# Altium project PCB_Project.PrjPcb (part 1 of 2)
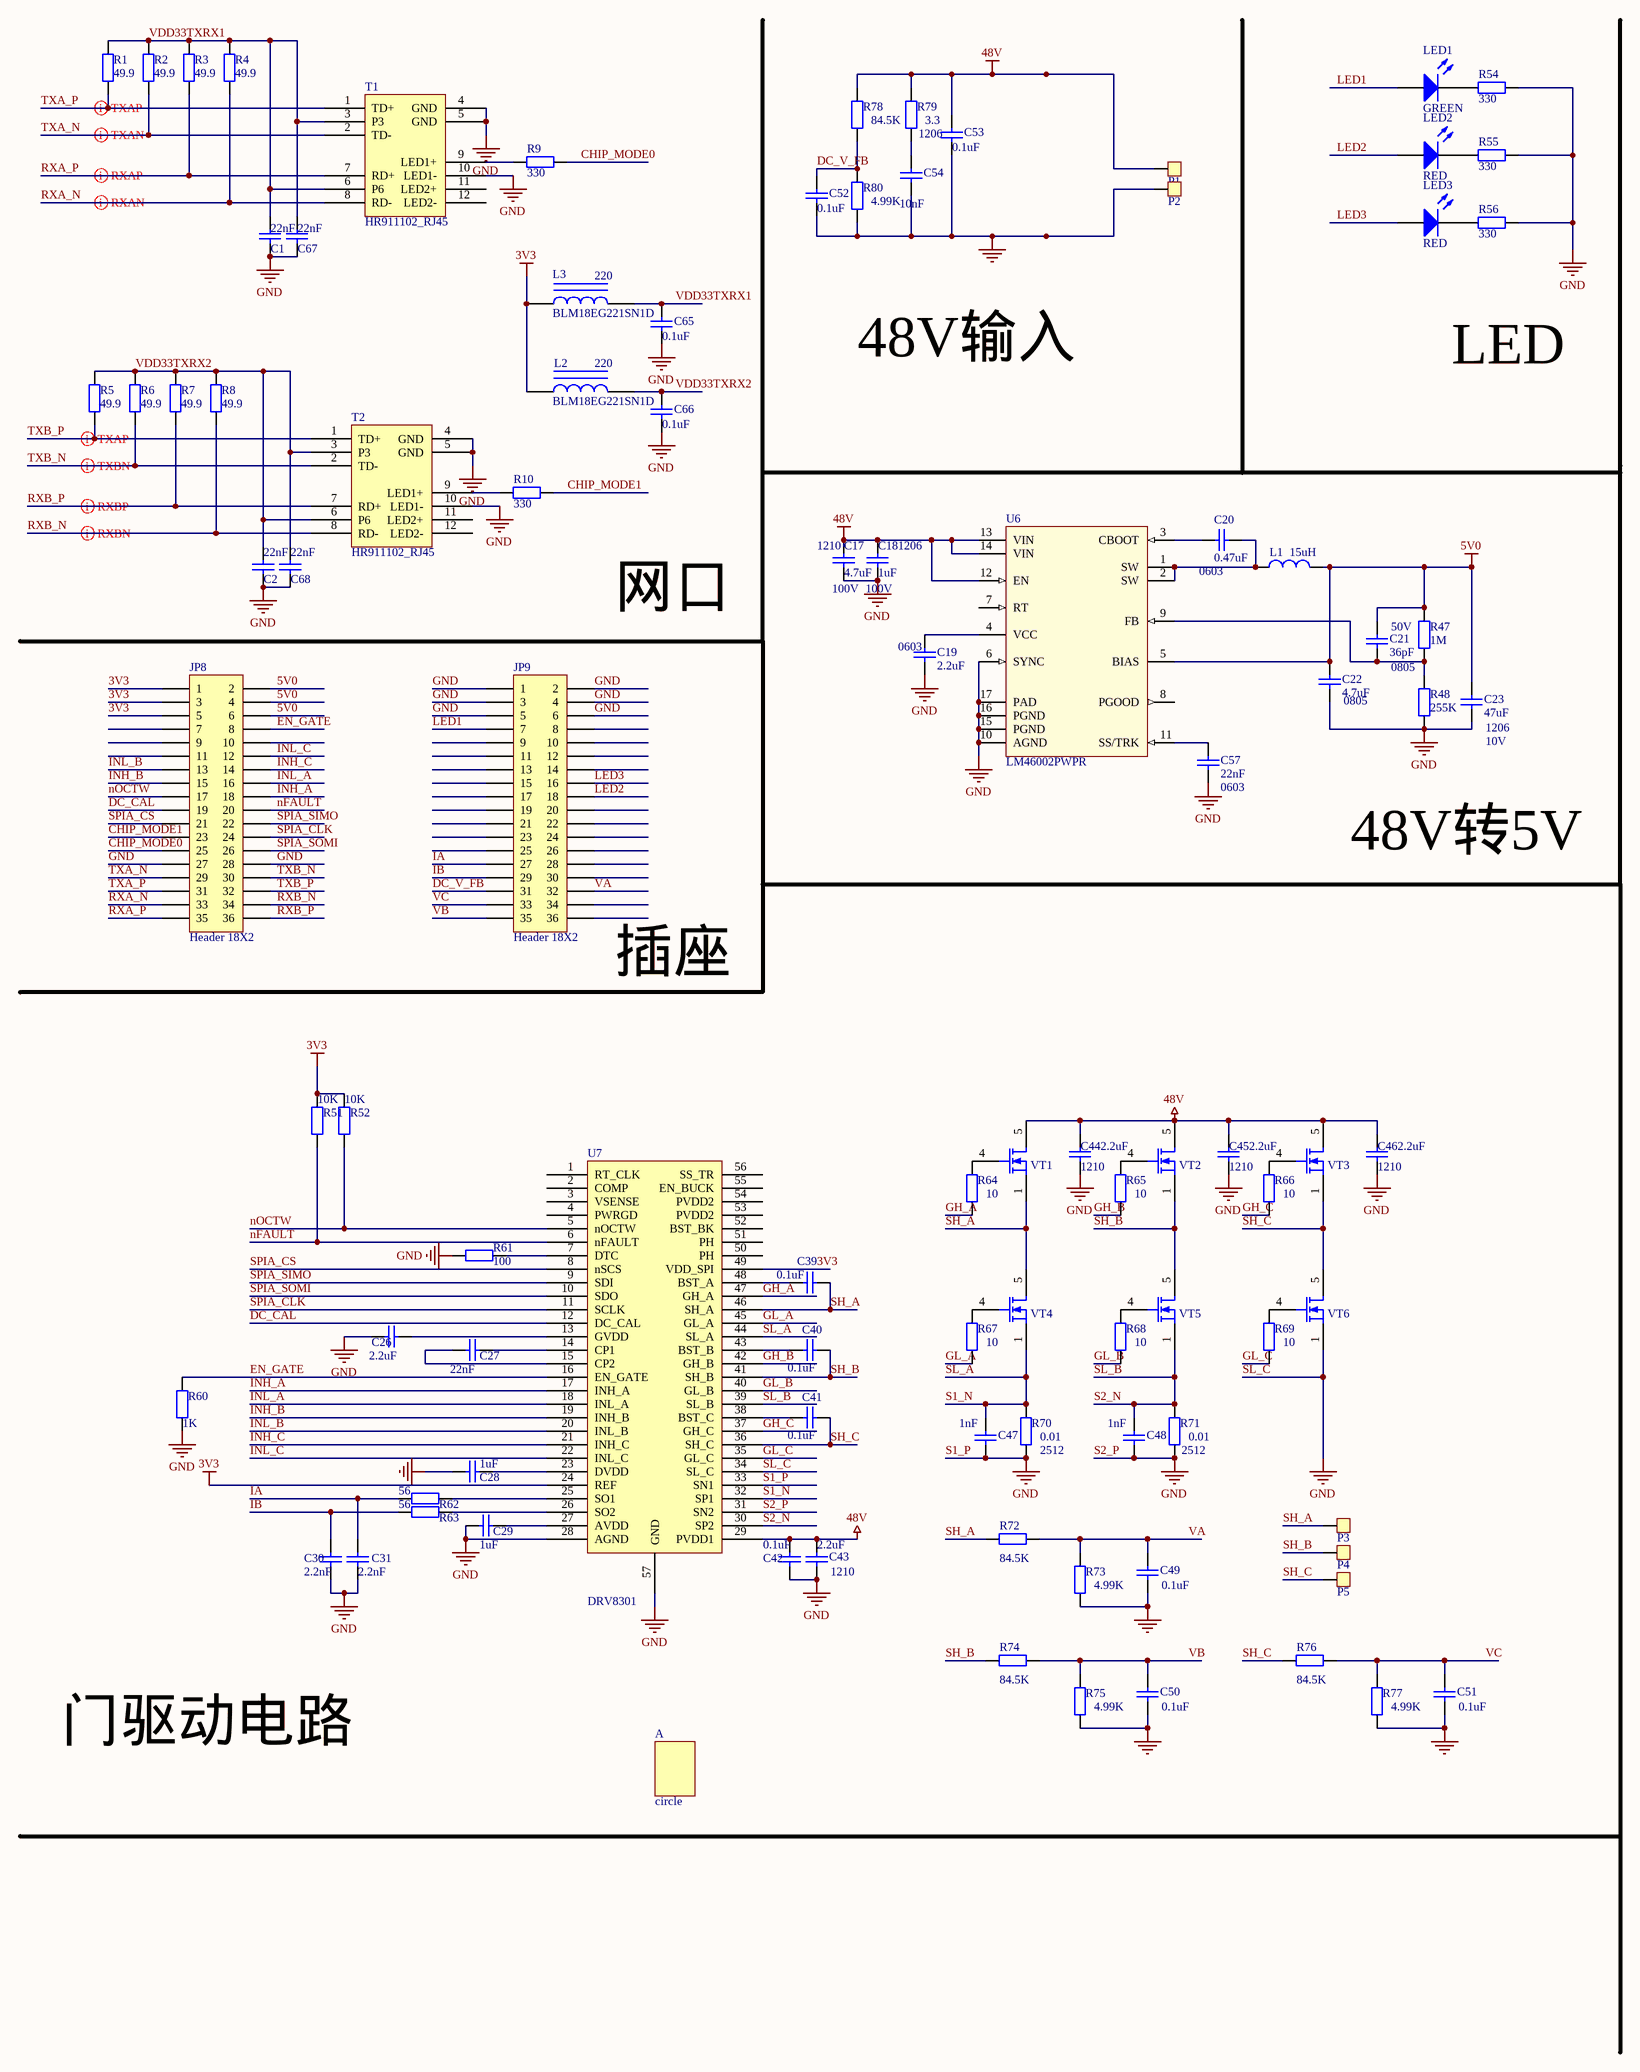
[diagram p0: diban.SchDoc]
4 sheets, 408 parts. Net scope: global (net labels, ports and power ports of the same name join across sheets).
Board files: diban_v1.0.PcbDoc, new.PcbDoc, diban_v1.0.~(10).PcbDoc, diban_v1.0.~(20).PcbDoc, encoder.PcbDoc
Sheets:
  diban.SchDoc
  new.SchDoc
  encoder.SchDoc
  Sheet1.SchDoc

## Sheet diban.SchDoc
size A2

### Parts
(Parts that share a designator on the sheet are numbered #1, #2 ... from top to bottom, then left to right.)
A#1  circle  [Circle]
C1#1  value 22nF  [CC1608-0603]  (hidden comment: 0603B223J6R3NT)
C2#1  value 22nF  [CC1608-0603]  (hidden comment: 0603B223J6R3NT)
C17#1  value 4.7uF  Voltage: 100V  Footpoint: 1210  [CC3225-1210]  (hidden comment: C3225X7S2A475M200AB)
C18  value 1uF  Voltage: 100V  Footpoint: 1206  [CC3216-1206]  (hidden comment: C3216X5R2A105K)
C19#1  value 2.2uF  Footpoint: 0603  [CC1608-0603]  (hidden comment: 0603B225J6R3NT)
C20#1  value 0.47uF  Footpoint: 0603  [CC1608-0603]  (hidden comment: 0603B474J6R3NT)
C21#1  value 36pF  Voltage: 50V  Footpoint: 0805  [CC2012-0805]  (hidden comment: CL21C360JBANNNC)
C22#1  value 4.7uF  Footpoint: 0805  [CC2012-0805]  (hidden comment: GRM21BR61E475KA12L)
C23#1  value 47uF  Footpoint: 1206  Voltage: 10V  [CC3216-1206]  (hidden comment: GRM31CR61A476KE15L)
C26#1  value 2.2uF  [CC2012-0805]  (hidden comment: 0603B225J6R3NT)
C27#1  value 22nF  [CC1608-0603]  (hidden comment: 0603B223J500NT)
C28#1  value 1uF  [CC1608-0603]  (hidden comment: 0603B105J250NT)
C29#1  value 1uF  [CC1608-0603]  (hidden comment: 0603B105J250NT)
C30#1  value 2.2nF  [CC1608-0603]  (hidden comment: 0603B222J6R3NT)
C31#1  value 2.2nF  [CC1608-0603]  (hidden comment: 0603B222J6R3NT)
C39#1  value 0.1uF  [CC1608-0603]  (hidden comment: 0603B104J500NT)
C40#1  value 0.1uF  [CC1608-0603]  (hidden comment: 0603B104J500NT)
C41#1  value 0.1uF  [CC1608-0603]  (hidden comment: 0603B104J500NT)
C42#1  value 0.1uF  [CC1608-0603]  (hidden comment: 0603B104J101NT)
C43#1  value 2.2uF  Footpoint: 1210  [CC3225-1210]  (hidden comment: GRM32ER72A225KA35L)
C44#1  value 2.2uF  Footpoint: 1210  [CC3225-1210]  (hidden comment: GRM32ER72A225KA35L)
C45#1  Footpoint: 1210  [CC3225-1210]  (hidden comment: GRM32ER72A225KA35L)
C46#1  Footpoint: 1210  [CC3225-1210]  (hidden comment: GRM32ER72A225KA35L)
C47#1  value 1nF  [CC1608-0603]  (hidden comment: 0603B102J500NT)
C48#1  value 1nF  [CC1608-0603]  (hidden comment: 0603B102J500NT)
C49#1  value 0.1uF  [CC1608-0603]  (hidden comment: 0603B104J160NT)
C50#1  value 0.1uF  [CC1608-0603]  (hidden comment: 0603B104J160NT)
C51#1  value 0.1uF  [CC1608-0603]  (hidden comment: 0603B104J160NT)
C52  value 0.1uF  [CC1608-0603]  (hidden comment: 0603B104J160NT)
C53#1  value 0.1uF  [CC1608-0603]  (hidden comment: 0603B104J101NT)
C54#1  value 10nF  [CC1608-0603]  (hidden comment: 0603B103J101NT)
C57#1  value 22nF  Footpoint: 0603  [CC1608-0603]  (hidden comment: 0603B223J6R3NT)
C65#1  value 0.1uF  [CC1608-0603]  (hidden comment: 0402B104J6R3NT)
C66#1  value 0.1uF  [CC1608-0603]  (hidden comment: 0402B104J6R3NT)
C67#1  value 22nF  [CC1608-0603]  (hidden comment: 0603B223J6R3NT)
C68#1  value 22nF  [CC1608-0603]  (hidden comment: 0603B223J6R3NT)
JP8  Header 18X2  [DC_1.27_36]
JP9  Header 18X2  [DC_1.27_36]
L1#1  value 15uH  [SPR6540]  (hidden comment: SPR6540-150M)
L2#1  BLM18EG221SN1D  value 220  [BLM0603]
L3#1  BLM18EG221SN1D  value 220  [BLM0603]
LED1  LED Chip  [0603D]  (value not drawn)
LED2  LED Chip  [0603D]  (value not drawn)
LED3  LED Chip  [0603D]  (value not drawn)
P1  PAD  [PAD]  (value not drawn)
P2  PAD  [PAD]  (value not drawn)
P3  PAD  [PAD]  (value not drawn)
P4  PAD  [PAD]  (value not drawn)
P5  PAD  [PAD]  (value not drawn)
R1#1  value 49.9  [CR1608-0603]  (hidden comment: RC03K49R9JT)
R2#1  value 49.9  [CR1608-0603]  (hidden comment: RC03K49R9JT)
R3#1  value 49.9  [CR1608-0603]  (hidden comment: RC03K49R9JT)
R4#1  value 49.9  [CR1608-0603]  (hidden comment: RC03K49R9JT)
R5#1  value 49.9  [CR1608-0603]  (hidden comment: RC03K49R9JT)
R6#1  value 49.9  [CR1608-0603]  (hidden comment: RC03K49R9JT)
R7#1  value 49.9  [CR1608-0603]  (hidden comment: RC03K49R9JT)
R8#1  value 49.9  [CR1608-0603]  (hidden comment: RC03K49R9JT)
R9#1  value 330  [CR1608-0603]  (hidden comment: RC03K331JT)
R10#1  value 330  [CR1608-0603]  (hidden comment: RC03K331JT)
R47  value 1M  [CR1608-0603]  (hidden comment: RC03K105JT)
R48#1  value 255K  [CR1608-0603]  (hidden comment: RC03K2553JT)
R51#1  value 10K  [CR1608-0603]  (hidden comment: RC03K103JT)
R52#1  value 10K  [CR1608-0603]  (hidden comment: RC03K103JT)
R54#1  value 330  [CR1608-0603]  (hidden comment: RC03K331JT)
R55#1  value 330  [CR1608-0603]  (hidden comment: RC03K331JT)
R56#1  value 330  [CR1608-0603]  (hidden comment: RC03K331JT)
R60#1  value 1K  [CR1608-0603]  (hidden comment: RC03K102JT)
R61  value 100  [CR1608-0603]  (hidden comment: RC03K101JT)
R62#1  value 56  [CR1608-0603]  (hidden comment: RC03K560JT)
R63#1  value 56  [CR1608-0603]  (hidden comment: RC03K560JT)
R64#1  value 10  [CR1608-0603]  (hidden comment: RC03K100JT)
R65#1  value 10  [CR1608-0603]  (hidden comment: RC03K100JT)
R66  value 10  [CR1608-0603]  (hidden comment: RC03K100JT)
R67  value 10  [CR1608-0603]  (hidden comment: RC03K100JT)
R68  value 10  [CR1608-0603]  (hidden comment: RC03K100JT)
R69  value 10  [CR1608-0603]  (hidden comment: RC03K100JT)
R70  value 0.01  Footpoint: 2512  [CR6332-2512]  (hidden comment: CRA2512-FZ-R010ELF)
R71  value 0.01  Footpoint: 2512  [CR6332-2512]  (hidden comment: CRA2512-FZ-R010ELF)
R72  value 84.5K  [CR1608-0603]  (hidden comment: RC03K8452JT)
R73  value 4.99K  [CR1608-0603]  (hidden comment: RC03K4991JT)
R74  value 84.5K  [CR1608-0603]  (hidden comment: RC03K8452JT)
R75  value 4.99K  [CR1608-0603]  (hidden comment: RC03K4991JT)
R76  value 84.5K  [CR1608-0603]  (hidden comment: RC03K8452JT)
R77  value 4.99K  [CR1608-0603]  (hidden comment: RC03K4991JT)
R78  value 84.5K  [CR1608-0603]  (hidden comment: RC03K8452JT)
R79  value 3.3  Footpoint: 1206  [CR3216-1206]  (hidden comment: CRCW12063R30JNEA)
R80  value 4.99K  [CR1608-0603]  (hidden comment: RC03K4991JT)
T1#1  HR911102_RJ45  [RJ45]
T2#1  HR911102_RJ45  [RJ45]
U6  LM46002PWPR  [IM46002]
U7#1  DRV8301  [DRV8301]
VT1  CSD18540  [CSD18540 - duplicate]  (value not drawn)
VT2  CSD18540  [CSD18540 - duplicate]  (value not drawn)
VT3  CSD18540  [CSD18540 - duplicate]  (value not drawn)
VT4  CSD18540  [CSD18540 - duplicate]  (value not drawn)
VT5  CSD18540  [CSD18540 - duplicate]  (value not drawn)
VT6  CSD18540  [CSD18540 - duplicate]  (value not drawn)

### Nets
3V3: JP8.1 JP8.3 JP8.5 L2#1.1 L3#1.1 R51#1.2 R52#1.2 U7#1.24(REF) U7#1.49(VDD_SPI)
5V0: C21#1.2 C22#1.2 C23#1.2 JP8.2 JP8.4 JP8.6 L1#1.2 R47.1 U6.5(BIAS)
48V: C17#1.1 C18.1 C42#1.2 C43#1.2 C44#1.1 C45#1.1 C46#1.1 C53#1.2 P1.1 R78.2 R79.2 U6.12(EN) U6.13(VIN) U6.14(VIN) U7#1.29(PVDD1) VT1.5(D) VT2.5(D) VT3.5(D)
GND: C1#1.1 C2#1.1 C17#1.2 C18.2 C19#1.2 C22#1.1 C23#1.1 C26#1.1 C28#1.1 C29#1.1 C30#1.1 C31#1.1 C42#1.1 C43#1.1 C44#1.2 C45#1.2 C46#1.2 C47#1.2 C48#1.2 C49#1.1 C50#1.1 C51#1.1 C52.1 C53#1.1 C54#1.1 C57#1.1 C65#1.1 C66#1.1 C67#1.1 C68#1.1 JP8.27 JP8.28 JP9.1 JP9.2 JP9.3 JP9.4 JP9.5 JP9.6 P2.1 R48#1.2 R54#1.1 R55#1.1 R56#1.1 R60#1.1 R61.1 R70.1 R71.1 R73.1 R75.1 R77.1 R80.1 T1#1.4(GND) T1#1.5(GND) T1#1.10(LED1-) T2#1.4(GND) T2#1.5(GND) T2#1.10(LED1-) U6.6(SYNC) U6.10(AGND) U6.15(PGND) U6.16(PGND) U6.17(PAD) U7#1.28(AGND) U7#1.31(SN2) U7#1.33(SN1) U7#1.34(SL_C) U7#1.57(GND) VT6.1(S)  [also labelled S1_P, S2_P, SL_C]
CHIP_MODE0: JP8.25 R9#1.1
CHIP_MODE1: JP8.23 R10#1.1
DC_CAL: JP8.19 U7#1.12(DC_CAL)
DC_V_FB: C52.2 JP9.31 R78.1 R80.2
EN_GATE: JP8.8 R60#1.2 U7#1.16(EN_GATE)
GH_A: R64#1.2 U7#1.47(GH_A)
GH_B: R65#1.2 U7#1.42(GH_B)
GH_C: R66.2 U7#1.37(GH_C)
GL_A: R67.2 U7#1.45(GL_A)
GL_B: R68.2 U7#1.40(GL_B)
GL_C: R69.2 U7#1.35(GL_C)
IA: C31#1.2 JP9.27 R62#1.1
IB: C30#1.2 JP9.29 R63#1.1
INH_A: JP8.18 U7#1.17(INH_A)
INH_B: JP8.15 U7#1.19(INH_B)
INH_C: JP8.14 U7#1.21(INH_C)
INL_A: JP8.16 U7#1.18(INL_A)
INL_B: JP8.13 U7#1.20(INL_B)
INL_C: JP8.12 U7#1.22(INL_C)
LED1: JP9.7 LED1.1(A)
LED2: JP9.18 LED2.1(A)
LED3: JP9.16 LED3.1(A)
nFAULT: JP8.20 R51#1.1 U7#1.6(nFAULT)
nOCTW: JP8.17 R52#1.1 U7#1.5(nOCTW)
RXA_N: JP8.33 R4#1.1 T1#1.8(RD-)
RXA_P: JP8.35 R3#1.1 T1#1.7(RD+)
RXB_N: JP8.34 R8#1.1 T2#1.8(RD-)
RXB_P: JP8.36 R7#1.1 T2#1.7(RD+)
S1_N: C47#1.1 R70.2 U7#1.32(SP1) U7#1.44(SL_A) VT4.1(S)  [also labelled SL_A]
S2_N: C48#1.1 R71.2 U7#1.30(SP2) U7#1.39(SL_B) VT5.1(S)  [also labelled SL_B]
SH_A: C39#1.2 P3.1 R72.1 U7#1.46(SH_A) VT1.1(S) VT4.5(D)
SH_B: C40#1.2 P4.1 R74.1 U7#1.41(SH_B) VT2.1(S) VT5.5(D)
SH_C: C41#1.2 P5.1 R76.1 U7#1.36(SH_C) VT3.1(S) VT6.5(D)
SPIA_CLK: JP8.24 U7#1.11(SCLK)
SPIA_CS: JP8.21 U7#1.8(nSCS)
SPIA_SIMO: JP8.22 U7#1.9(SDI)
SPIA_SOMI: JP8.26 U7#1.10(SDO)
TXA_N: JP8.29 R2#1.1 T1#1.2(TD-)
TXA_P: JP8.31 R1#1.1 T1#1.1(TD+)
TXB_N: JP8.30 R6#1.1 T2#1.2(TD-)
TXB_P: JP8.32 R5#1.1 T2#1.1(TD+)
VA: C49#1.2 JP9.32 R72.2 R73.2
VB: C50#1.2 JP9.35 R74.2 R75.2
VC: C51#1.2 JP9.33 R76.2 R77.2
VDD33TXRX1: C1#1.2 C65#1.2 C67#1.2 L3#1.2 R1#1.2 R2#1.2 R3#1.2 R4#1.2 T1#1.3(P3) T1#1.6(P6)
VDD33TXRX2: C2#1.2 C66#1.2 C68#1.2 L2#1.2 R5#1.2 R6#1.2 R7#1.2 R8#1.2 T2#1.3(P3) T2#1.6(P6)
NetC19#1_1: C19#1.1 U6.4(VCC)
NetC20#1_1: C20#1.1 U6.3(CBOOT)
NetC20#1_2: C20#1.2 L1#1.1 U6.1(SW) U6.2(SW)
NetC21#1_1: C21#1.1 R47.2 R48#1.1 U6.9(FB)
NetC26#1_2: C26#1.2 U7#1.13(GVDD)
NetC27#1_1: C27#1.1 U7#1.15(CP2)
NetC27#1_2: C27#1.2 U7#1.14(CP1)
NetC28#1_2: C28#1.2 U7#1.23(DVDD)
NetC29#1_2: C29#1.2 U7#1.27(AVDD)
NetC39#1_1: C39#1.1 U7#1.48(BST_A)
NetC40#1_1: C40#1.1 U7#1.43(BST_B)
NetC41#1_1: C41#1.1 U7#1.38(BST_C)
NetC54#1_2: C54#1.2 R79.1
NetC57#1_2: C57#1.2 U6.11(SS/TRK)
NetLED1_2: LED1.2(K) R54#1.2
NetLED2_2: LED2.2(K) R55#1.2
NetLED3_2: LED3.2(K) R56#1.2
NetR9#1_2: R9#1.2 T1#1.9(LED1+)
NetR10#1_2: R10#1.2 T2#1.9(LED1+)
NetR61_2: R61.2 U7#1.7(DTC)
NetR62#1_2: R62#1.2 U7#1.25(SO1)
NetR63#1_2: R63#1.2 U7#1.26(SO2)
NetR64#1_1: R64#1.1 VT1.4(G)
NetR65#1_1: R65#1.1 VT2.4(G)
NetR66_1: R66.1 VT3.4(G)
NetR67_1: R67.1 VT4.4(G)
NetR68_1: R68.1 VT5.4(G)
NetR69_1: R69.1 VT6.4(G)

Not connected (* = marked no-connect by the designer): JP8 7 9 10 11; JP9 8 9 10 11 12 13 14 15 17 19 20 21 22 23 24 25 26 28 30 34 36; T1#1 11(LED2+) 12(LED2-); T2#1 11(LED2+) 12(LED2-); U6 7(RT) 8(PGOOD); U7#1 1(RT_CLK) 2(COMP) 3(VSENSE) 4(PWRGD) 50(PH) 51(PH) 52(BST_BK) 53(PVDD2) 54(PVDD2) 55(EN_BUCK) 56(SS_TR)

### Layout directives
differential pair: RXA_N, RXA_P, RXB_N, RXB_P, TXA_N, TXA_P, TXB_N, TXB_P

### Notes on the sheet
- 48V输入
- LED
- 网口
- 48V转5V
- (near JP9) 插座
- 门驱动电路
- (in symbol CAP) 2.2uF
- (in symbol LED Chip) GREEN; RED

### Library data of the parts
C1#1 C2#1 C17#1 C18 C19#1 C20#1 C21#1 C22#1 C23#1 C26#1 C27#1 C28#1 C29#1 C30#1 C31#1 C39#1 C40#1 C41#1 C42#1 C43#1 C44#1 C45#1 C46#1 C47#1 C48#1 C49#1 C50#1 C51#1 C52 C53#1 C54#1 C57#1 C65#1 C66#1 C67#1 C68#1 = CAP
JP8 JP9 = Header 18X2: Header,36-Pin, Dual row; LatestRevisionDate: 17-Jul-2002; LatestRevisionNote: Re-released for DXP Platform.; Publisher: Altium Limited
L1#1 = Inductor Chip: Inductor; Published: *; Revision: *; Publisher: *
L2#1 L3#1 = Inductor Iron: Magnetic-Core Inductor; Published: *; Revision: *; Publisher: *
LED1-LED3 = LED Chip: Typical Chip LED; Published: 8-Jun-2000; Revision: July-2002: Re-released for DXP Platform.; Publisher: Altium Limited
R1#1 R2#1 R3#1 R4#1 R5#1 R6#1 R7#1 R8#1 R9#1 R10#1 R47 R48#1 R51#1 R52#1 R54#1 R55#1 R56#1 R60#1 R61 R62#1 R63#1 R64#1 R65#1 R66-R80 = Resistor
U6 = LM46002PWPR: Imported; Alternate Manufacturer: None; Manufacturer: Texas Instruments; CurrentTime: Not shown in title block; DocumentNumber: 1; SymbolCreator: a0411947; CompType: IC; U/M: EA; Designator: U?; PIN_COUNT: 17; CurrentDate: Not shown in title block; Time: Not shown in title block; Date: Not shown in title block; DocumentFullPathAndName: Not shown in title block; DocumentName: Not shown in title block; ModifiedDate: Not shown in title block; ApprovedBy: Not shown in title block; CheckedBy: Not shown in title block; Author: Not shown in title block; CompanyName: Not shown in title block; Engineer: Not shown in title block; Organization: Not shown in title block; Address1: Not shown in title block; Address2: Not shown in title block; Address3: Not shown in title block; Address4: Not shown in title block; Revision: Use project parameter SCH_Rev; SheetNumber: 1; SheetTotal: 1; ImagePath: Not shown in title block; Rule: *; ProjectName: *; SymbolVersion: 2014-01-28; PartNumber: LM46002PWP; PackageReference: PWP0016A; MountType: SMT; ComponentLink1Description: Datasheet Link; ComponentLink1URL: https://sps06.itg.ti.com/sites/KMS/crossdivteams/altium/docs/ComponentDatasheets/LM46002-PrelimDS-2014-1-16.pdf; RoHS: Y; Publisher: Texas Instruments; LatestRevisionDate: 2014-02-20; RefDes: RefDes; Type: DEV; Value: Value

## Sheet new.SchDoc
size A2
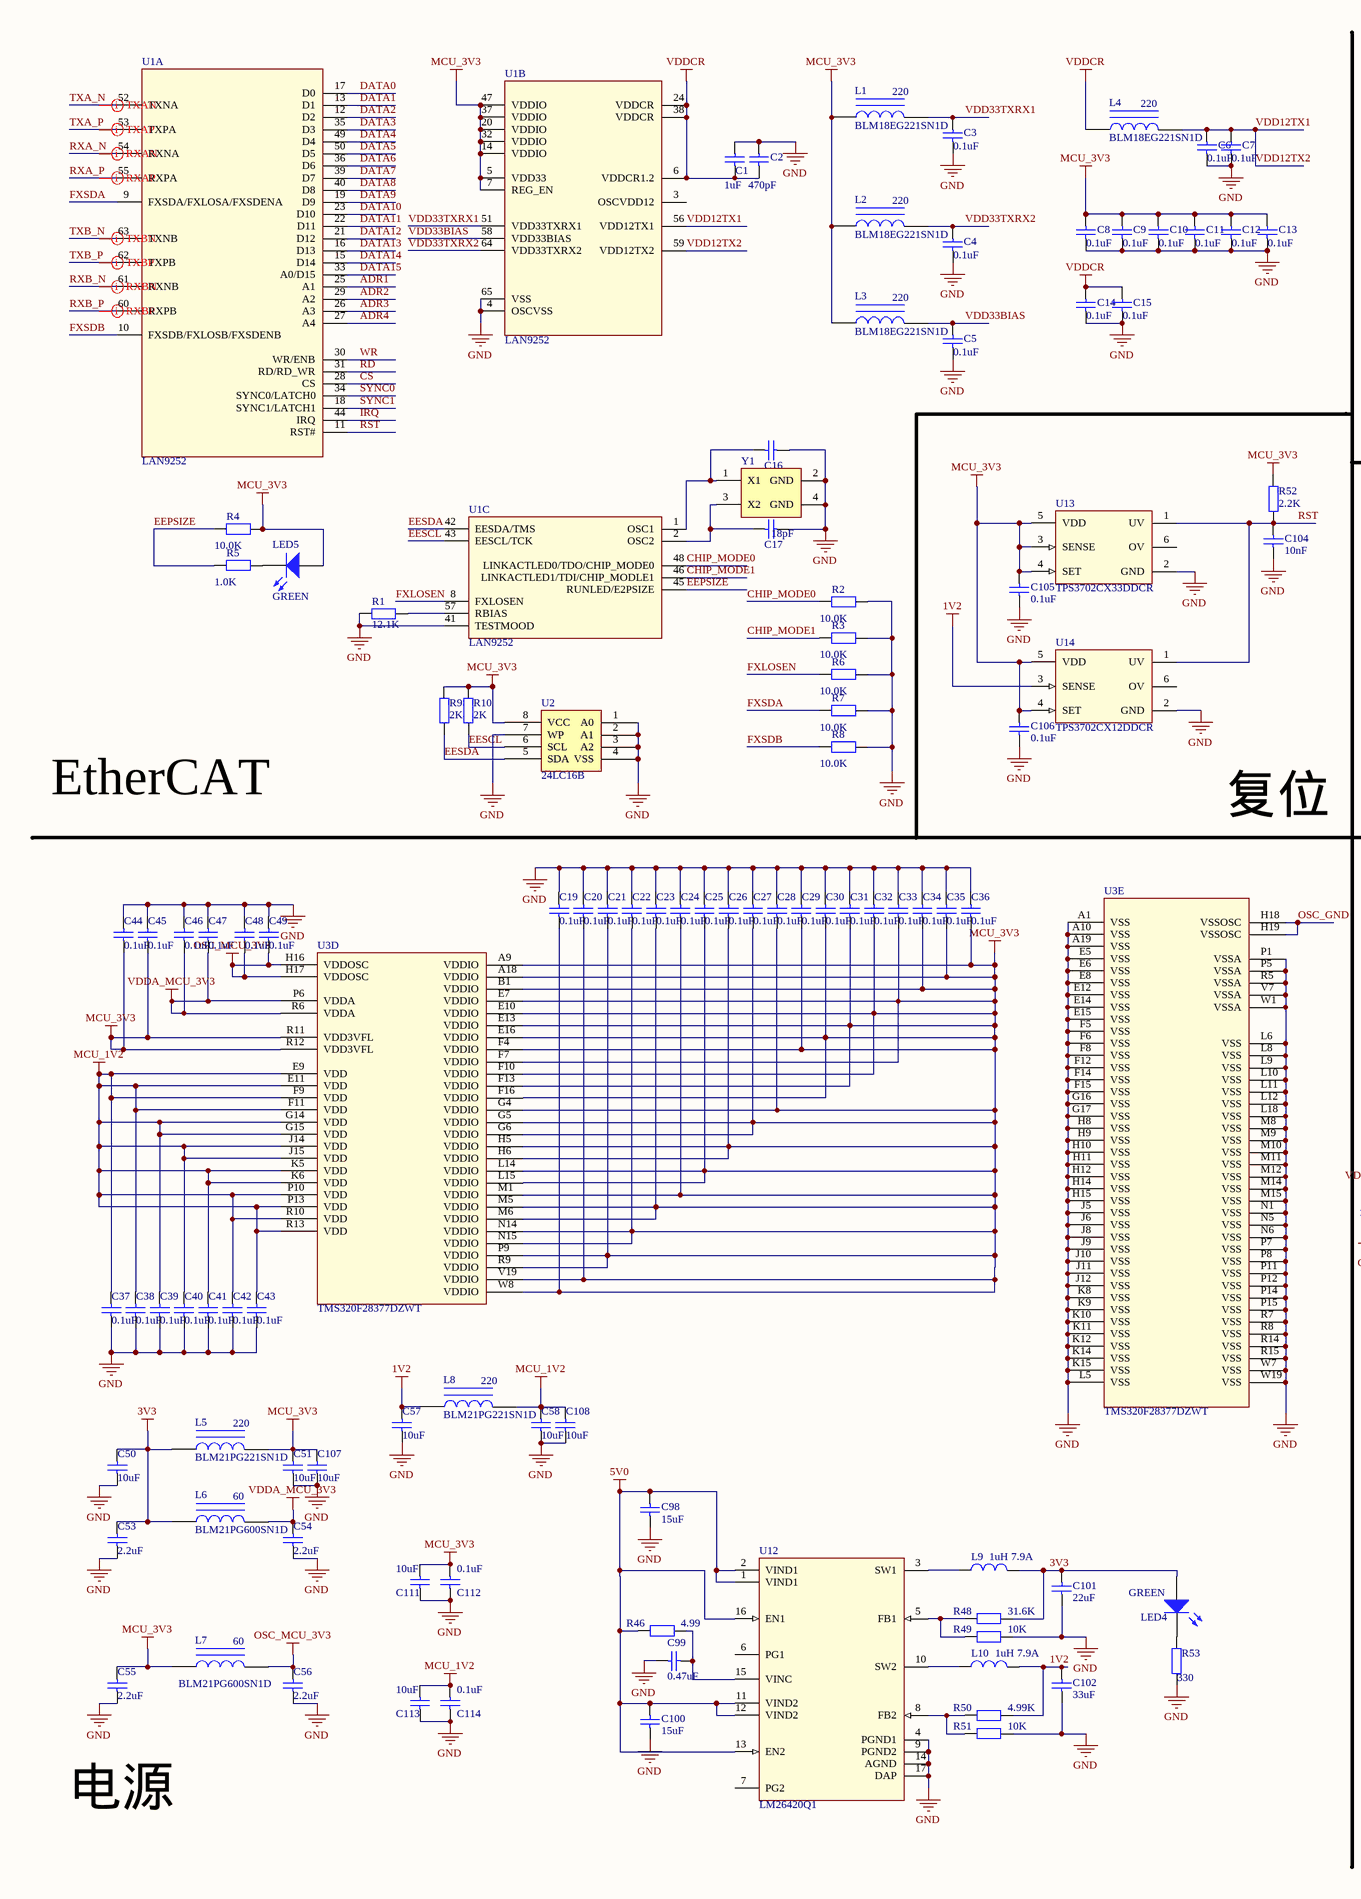
[diagram p1: new.SchDoc, left]
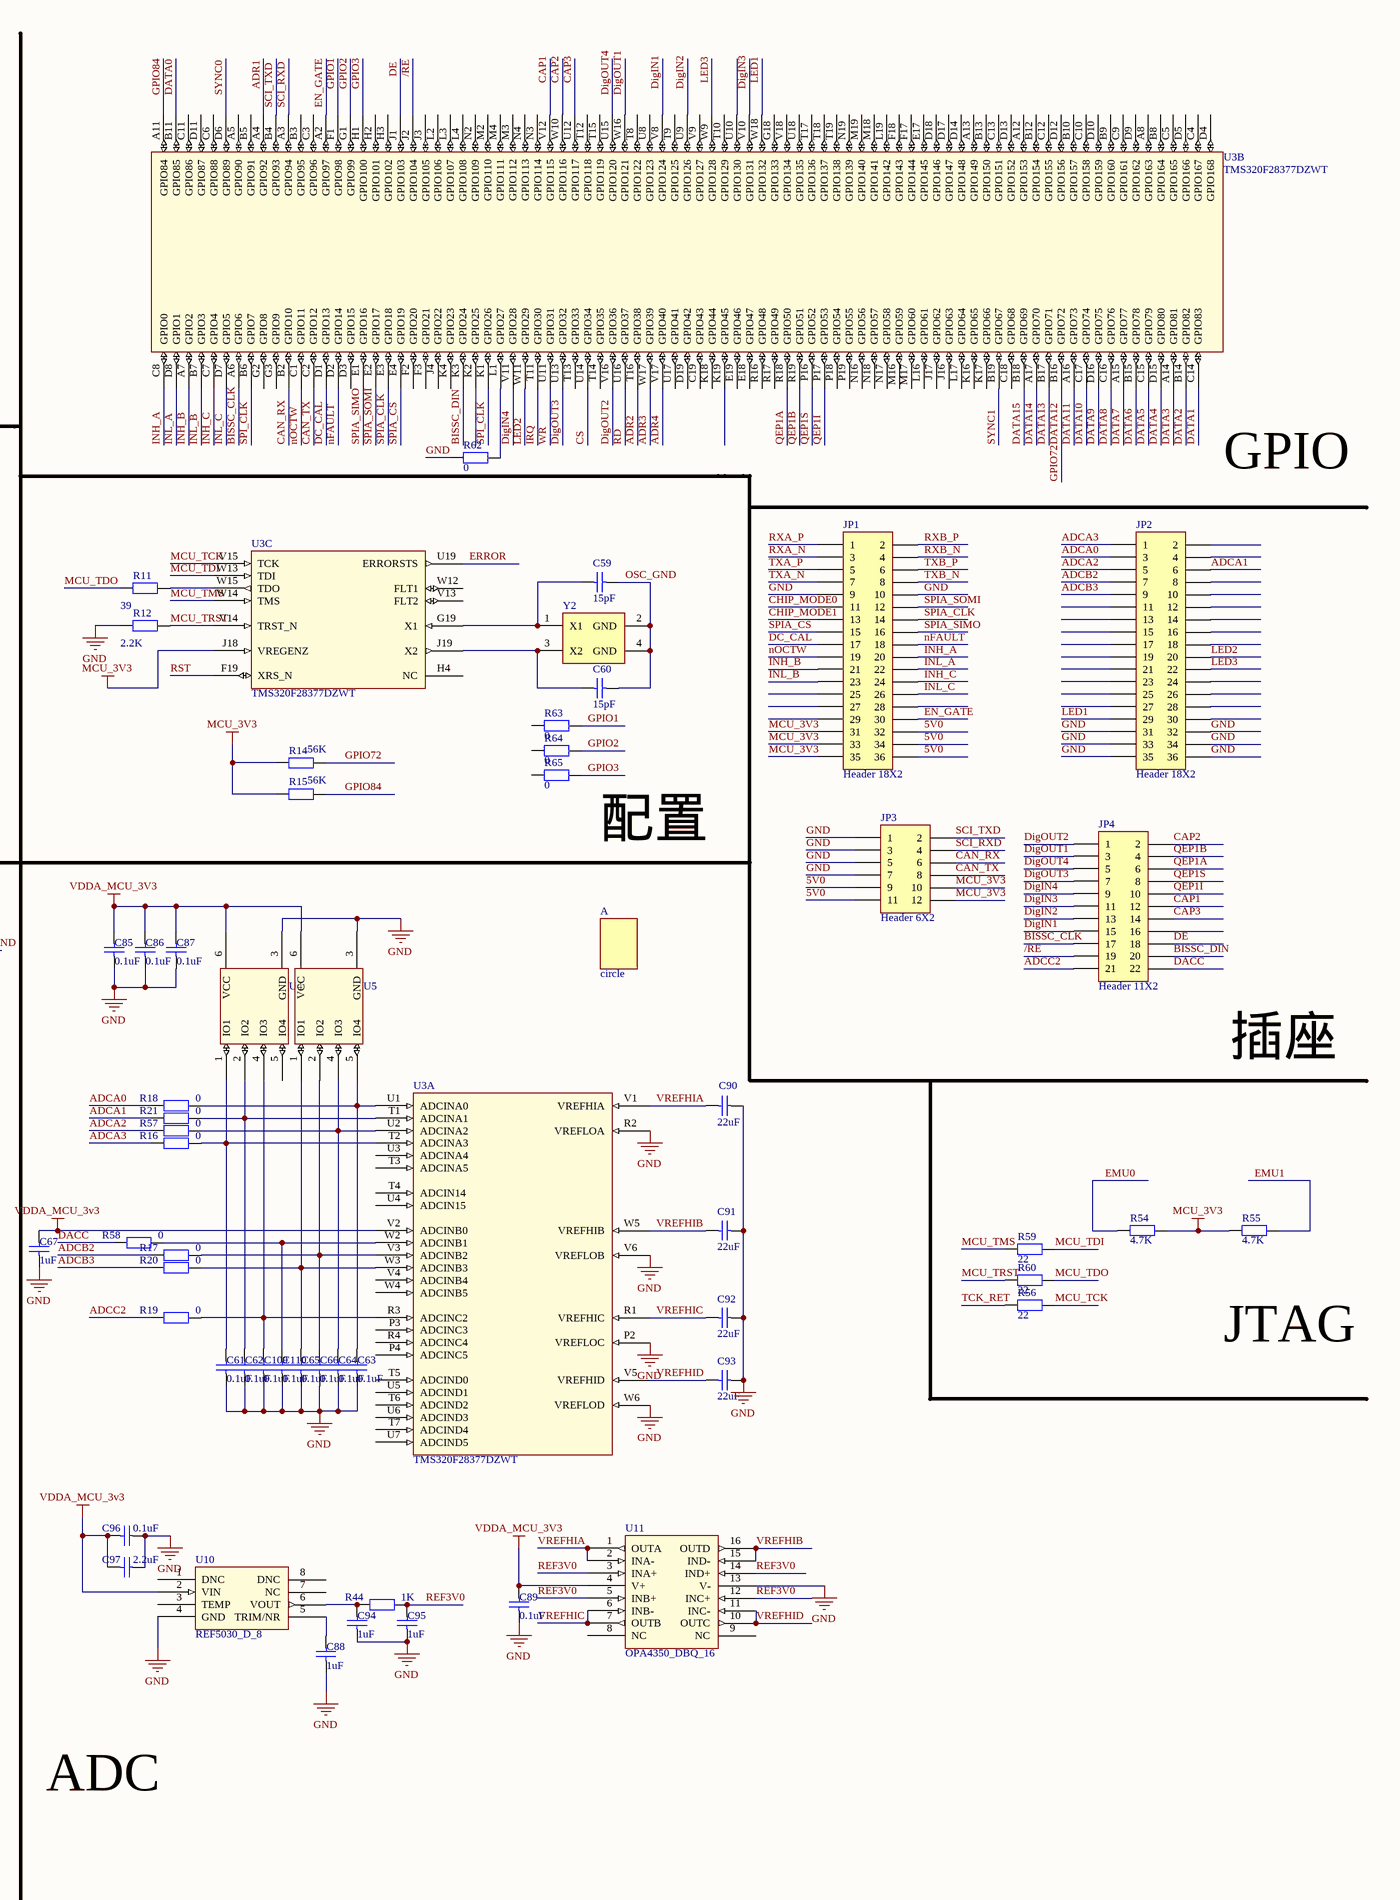
[diagram p2: new.SchDoc, right]

### Parts
(Parts that share a designator on the sheet are numbered #1, #2 ... from top to bottom, then left to right.)
A#2  circle  [Circle]
C1#2  value 1uF  [CC1608-0603]  (hidden comment: 0603B105J6R3NT)
C2#2  value 470pF  [CC1005-0402]  (hidden comment: 0402B471J6R3NT)
C3#1  value 0.1uF  [CC1005-0402]  (hidden comment: 0402B104J6R3NT)
C4#1  value 0.1uF  [CC1005-0402]  (hidden comment: 0402B104J6R3NT)
C5#1  value 0.1uF  [CC1005-0402]  (hidden comment: 0402B104J6R3NT)
C6#1  value 0.1uF  [CC1005-0402]  (hidden comment: 0402B104J6R3NT)
C7#1  value 0.1uF  [CC1005-0402]  (hidden comment: 0402B104J6R3NT)
C8#1  value 0.1uF  [CC1005-0402]  (hidden comment: 0402B104J6R3NT)
C9#1  value 0.1uF  [CC1005-0402]  (hidden comment: 0402B104J6R3NT)
C10#1  value 0.1uF  [CC1005-0402]  (hidden comment: 0402B104J6R3NT)
C11#1  value 0.1uF  [CC1005-0402]  (hidden comment: 0402B104J6R3NT)
C12#1  value 0.1uF  [CC1005-0402]  (hidden comment: 0402B104J6R3NT)
C13#1  value 0.1uF  [CC1005-0402]  (hidden comment: 0402B104J6R3NT)
C14#1  value 0.1uF  [CC1005-0402]  (hidden comment: 0402B104J6R3NT)
C15#1  value 0.1uF  [CC1005-0402]  (hidden comment: 0402B104J6R3NT)
C16#1  value 18pF  [CC1005-0402]  (hidden comment: 0402B180J6R3NT)
C17#2  Vaule: 18pF  [CC1005-0402]  (hidden comment: 0402B180J6R3NT)
C19#2  value 0.1uF  [CC1005-0402]  (hidden comment: 0402B104J6R3NT)
C20#2  value 0.1uF  [CC1005-0402]  (hidden comment: 0402B104J6R3NT)
C21#2  value 0.1uF  [CC1005-0402]  (hidden comment: 0402B104J6R3NT)
C22#2  value 0.1uF  [CC1005-0402]  (hidden comment: 0402B104J6R3NT)
C23#2  value 0.1uF  [CC1005-0402]  (hidden comment: 0402B104J6R3NT)
C24  value 0.1uF  [CC1005-0402]  (hidden comment: 0402B104J6R3NT)
C25  value 0.1uF  [CC1005-0402]  (hidden comment: 0402B104J6R3NT)
C26#2  value 0.1uF  [CC1005-0402]  (hidden comment: 0402B104J6R3NT)
C27#2  value 0.1uF  [CC1005-0402]  (hidden comment: 0402B104J6R3NT)
C28#2  value 0.1uF  [CC1005-0402]  (hidden comment: 0402B104J6R3NT)
C29#2  value 0.1uF  [CC1005-0402]  (hidden comment: 0402B104J6R3NT)
C30#2  value 0.1uF  [CC1005-0402]  (hidden comment: 0402B104J6R3NT)
C31#2  value 0.1uF  [CC1005-0402]  (hidden comment: 0402B104J6R3NT)
C32  value 0.1uF  [CC1005-0402]  (hidden comment: 0402B104J6R3NT)
C33  value 0.1uF  [CC1005-0402]  (hidden comment: 0402B104J6R3NT)
C34  value 0.1uF  [CC1005-0402]  (hidden comment: 0402B104J6R3NT)
C35  value 0.1uF  [CC1005-0402]  (hidden comment: 0402B104J6R3NT)
C36  value 0.1uF  [CC1005-0402]  (hidden comment: 0402B104J6R3NT)
C37  value 0.1uF  [CC1005-0402]  (hidden comment: 0402B104J6R3NT)
C38  value 0.1uF  [CC1005-0402]  (hidden comment: 0402B104J6R3NT)
C39#2  value 0.1uF  [CC1005-0402]  (hidden comment: 0402B104J6R3NT)
C40#2  value 0.1uF  [CC1005-0402]  (hidden comment: 0402B104J6R3NT)
C41#2  value 0.1uF  [CC1005-0402]  (hidden comment: 0402B104J6R3NT)
C42#2  value 0.1uF  [CC1005-0402]  (hidden comment: 0402B104J6R3NT)
C43#2  value 0.1uF  [CC1005-0402]  (hidden comment: 0402B104J6R3NT)
C44#2  value 0.1uF  [CC1005-0402]  (hidden comment: 0402B104J6R3NT)
C45#2  value 0.1uF  [CC1005-0402]  (hidden comment: 0402B104J6R3NT)
C46#2  value 0.1uF  [CC1005-0402]  (hidden comment: 0402B104J6R3NT)
C47#2  value 0.1uF  [CC1005-0402]  (hidden comment: 0402B104J6R3NT)
C48#2  value 0.1uF  [CC1005-0402]  (hidden comment: 0402B104J6R3NT)
C49#2  value 0.1uF  [CC1005-0402]  (hidden comment: 0402B104J6R3NT)
C50#2  value 10uF  [CC1608-0603]  (hidden comment: 0603B106J6R3NT)
C51#2  value 10uF  [CC1608-0603]  (hidden comment: 0603B106J6R3NT)
C53#2  value 2.2uF  [CC1608-0603]  (hidden comment: 0603B225J6R3NT)
C54#2  value 2.2uF  [CC1608-0603]  (hidden comment: 0603B225J6R3NT)
C55  value 2.2uF  [CC1608-0603]  (hidden comment: 0603B225J6R3NT)
C56  value 2.2uF  [CC1608-0603]  (hidden comment: 0603B225J6R3NT)
C57#2  value 10uF  [CC1608-0603]  (hidden comment: 0603B106J6R3NT)
C58#1  value 10uF  [CC1608-0603]  (hidden comment: 0603B106J6R3NT)
C59#1  value 15pF  [CC1005-0402]  (hidden comment: 0402B150J6R3NT)
C60#1  value 15pF  [CC1005-0402]  (hidden comment: 0402B150J6R3NT)
C61#1  value 0.1uF  [CC1005-0402]  (hidden comment: 0402B104J6R3NT)
C62  value 0.1uF  [CC1005-0402]  (hidden comment: 0402B104J6R3NT)
C63  value 0.1uF  [CC1005-0402]  (hidden comment: 0402B104J6R3NT)
C64  value 0.1uF  [CC1005-0402]  (hidden comment: 0402B104J6R3NT)
C65#2  value 0.1uF  [CC1005-0402]  (hidden comment: 0402B104J6R3NT)
C66#2  value 0.1uF  [CC1005-0402]  (hidden comment: 0402B104J6R3NT)
C67#2  value 1uF  [CC1005-0402]  (hidden comment: 0402B105J6R3NT)
C85  value 0.1uF  [CC1005-0402]  (hidden comment: 0402B104J6R3NT)
C86  value 0.1uF  [CC1005-0402]  (hidden comment: 0402B104J6R3NT)
C87  value 0.1uF  [CC1005-0402]  (hidden comment: 0402B104J6R3NT)
C88  value 1uF  [CC1608-0603]  (hidden comment: 0603B105J6R3NT)
C89  value 0.1uF  [CC1005-0402]  (hidden comment: 0402B104J6R3NT)
C90  value 22uF  [CC2012-0805]  (hidden comment: 0805B226J6R3NT)
C91  value 22uF  [CC2012-0805]  (hidden comment: 0805B226J6R3NT)
C92  value 22uF  [CC2012-0805]  (hidden comment: 0805B226J6R3NT)
C93  value 22uF  [CC2012-0805]  (hidden comment: 0805B226J6R3NT)
C94  value 1uF  [CC1608-0603]  (hidden comment: 0603B105J6R3NT)
C95  value 1uF  [CC1608-0603]  (hidden comment: 0603B105J6R3NT)
C96  value 0.1uF  [CC1005-0402]  (hidden comment: 0402B104J6R3NT)
C97  value 2.2uF  [CC1608-0603]  (hidden comment: 0603B225J6R3NT)
C98  value 15uF  [CC3216-1206]  (hidden comment: 1206B156J6R3NT)
C99  value 0.47uF  [CC2012-0805]  (hidden comment: 0805B474J6R3NT)
C100  value 15uF  [CC3216-1206]  (hidden comment: 1206B156J6R3NT)
C101  value 22uF  [CC3216-1206]  (hidden comment: 1206B226J6R3NT)
C102  value 33uF  [CC3225-1210]  (hidden comment: 1206B336J6R3NT)
C104#1  value 10nF  [CC1005-0402]  (hidden comment: 0402B103J6R3NT)
C105#1  value 0.1uF  [CC1005-0402]  (hidden comment: 0402B104J6R3NT)
C106#1  value 0.1uF  [CC1005-0402]  (hidden comment: 0402B104J6R3NT)
C107  value 10uF  [CC1608-0603]  (hidden comment: 0603B106J6R3NT)
C108  value 10uF  [CC1608-0603]  (hidden comment: 0603B106J6R3NT)
C109  value 0.1uF  [CC1005-0402]  (hidden comment: 0402B104J6R3NT)
C110  value 0.1uF  [CC1005-0402]  (hidden comment: 0402B104J6R3NT)
C111  value 10uF  [CC1608-0603]  (hidden comment: 0603B106J6R3NT)
C112  value 0.1uF  [CC1005-0402]  (hidden comment: 0402B104J6R3NT)
C113  value 10uF  [CC1608-0603]  (hidden comment: 0603B106J6R3NT)
C114  value 0.1uF  [CC1005-0402]  (hidden comment: 0402B104J6R3NT)
JP1#1  Header 18X2  [DC_1.27_36]
JP2#1  Header 18X2  [DC_1.27_36]
JP3  Header 6X2  [DC_1.27_12]
JP4  Header 11X2  [DC_1.27_22]
L1#2  BLM18EG221SN1D  value 220  [BLM0603]
L2#2  BLM18EG221SN1D  value 220  [BLM0603]
L3#2  BLM18EG221SN1D  value 220  [BLM0603]
L4#1  BLM18EG221SN1D  value 220  [BLM0603]
L5  BLM21PG221SN1D  value 220  [BLM0805]
L6  BLM21PG600SN1D  value 60  [BLM0805]
L7  BLM21PG600SN1D  value 60  [BLM0805]
L8  BLM21PG221SN1D  value 220  [BLM0805]
L9  value 1uH 7.9A  [RLF7030T]  (hidden comment: RLF7030T-1R0M6R4)
L10  value 1uH 7.9A  [RLF7030T]  (hidden comment: RLF7030T-1R0M6R4)
LED4  LED Chip  [0603D]  (value not drawn)
LED5#1  LED Chip  [0603D]  (value not drawn)
R1#2  value 12.1K  [CR1005-0402]  (hidden comment: RC02K1212JT)
R2#2  value 10.0K  [CR1005-0402]  (hidden comment: RC02K6103JT)
R3#2  value 10.0K  [CR1005-0402]  (hidden comment: RC02K6103JT)
R4#2  value 10.0K  [CR1005-0402]  (hidden comment: RC02K6103JT)
R5#2  value 1.0K  [CR1005-0402]  (hidden comment: RC02K6102JT)
R6#2  value 10.0K  [CR1005-0402]  (hidden comment: RC02K6103JT)
R7#2  value 10.0K  [CR1005-0402]  (hidden comment: RC02K6103JT)
R8#2  value 10.0K  [CR1005-0402]  (hidden comment: RC02K6103JT)
R9#2  value 2K  [CR1005-0402]  (hidden comment: RC02K202JT)
R10#2  value 2K  [CR1005-0402]  (hidden comment: RC02K202JT)
R11#1  value 39  [CR1005-0402]  (hidden comment: RC02K390JT)
R12#1  value 2.2K  [CR1005-0402]  (hidden comment: RC02K222JT)
R14#1  value 56K  [CR1005-0402]  (hidden comment: RC02K563JT)
R15#1  value 56K  [CR1005-0402]  (hidden comment: RC02K563JT)
R16#1  value 0  [CR1005-0402]  (hidden comment: RC02K000JT)
R17#1  value 0  [CR1005-0402]  (hidden comment: RC02K000JT)
R18#1  value 0  [CR1005-0402]  (hidden comment: RC02K000JT)
R19#1  value 0  [CR1005-0402]  (hidden comment: RC02K000JT)
R20  value 0  [CR1005-0402]  (hidden comment: RC02K000JT)
R21  value 0  [CR1005-0402]  (hidden comment: RC02K000JT)
R44  value 1K  [CR1608-0603]  (hidden comment: RC03K102JT)
R46#1  value 4.99  [CR1608-0603]  (hidden comment: RC03K4R99JT)
R48#2  value 31.6K  [CR1608-0603]  (hidden comment: RC03K3162JT)
R49  value 10K  [CR1608-0603]  (hidden comment: RC03K103JT)
R50  value 4.99K  [CR1608-0603]  (hidden comment: RC03K4991JT)
R51#2  value 10K  [CR1608-0603]  (hidden comment: RC03K103JT)
R52#2  value 2.2K  [CR1005-0402]  (hidden comment: RC02K222JT)
R53  value 330  [CR1608-0603]  (hidden comment: RC03K331JT)
R54#2  value 4.7K  [CR1005-0402]  (hidden comment: RC02K472JT)
R55#2  value 4.7K  [CR1005-0402]  (hidden comment: RC02K472JT)
R56#2  value 22  [CR1608-0603]  (hidden comment: RC02K220JT)
R57#1  value 0  [CR1005-0402]  (hidden comment: RC02K000JT)
R58#1  value 0  [CR1005-0402]  (hidden comment: RC02K000JT)
R59#1  value 22  [CR1608-0603]  (hidden comment: RC02K220JT)
R60#2  value 22  [CR1608-0603]  (hidden comment: RC02K220JT)
R62#2  value 0  [CR1005-0402]  (hidden comment: RC02K000JT)
R63#2  value 0  [CR1005-0402]  (hidden comment: RC02K000JT)
R64#2  value 0  [CR1005-0402]  (hidden comment: RC02K000JT)
R65#2  value 0  [CR1005-0402]  (hidden comment: RC02K000JT)
U1#1  LAN9252  [LAN9252]  (parts A,B,C of 3)
U2#1  24LC16B  [24FC512]
U3#1  TMS320F28377DZWT  [TMS320F28377D]  (parts A,B,C,D,E of 5)
U4#1  TPD4E001_DRL_6  [TPD4E001]  (value not drawn)
U5#1  TPD4E001_DRL_6  [TPD4E001]  (value not drawn)
U10  REF5030_D_8  [REF5030]
U11  OPA4350_DBQ_16  [OPA4350]
U12  LM26420Q1  [LM26420]
U13#1  TPS3702CX33DDCR  [TPS3702]
U14#1  TPS3702CX12DDCR  [TPS3702]
Y1#1  25MHz  [7B-20MHz]  (value not drawn)
Y2  XTAL1  [7B-20MHz]  (value not drawn)

### Nets
1V2: C57#2.1 C102.1 L8.1 L10.2 R50.2 U14#1.3(SENSE)
3V3: C50#2.1 C53#2.1 C101.1 L5.1 L6.1 L9.2 LED4.1(A) R48#2.2
5V0: C98.1 C100.1 JP1#1.32 JP1#1.34 JP1#1.36 JP3.9 JP3.11 R46#1.1 U12.1(VIND1) U12.2(VIND1) U12.11(VIND2) U12.12(VIND2) U12.13(EN2) U12.16(EN1)
GND: C1#2.2 C2#2.2 C3#1.1 C4#1.1 C5#1.1 C6#1.1 C7#1.1 C8#1.1 C9#1.1 C10#1.1 C11#1.1 C12#1.1 C13#1.1 C14#1.1 C15#1.1 C16#1.1 C17#2.1 C19#2.1 C20#2.1 C21#2.1 C22#2.1 C23#2.1 C24.1 C25.1 C26#2.1 C27#2.1 C28#2.1 C29#2.1 C30#2.1 C31#2.1 C32.1 C33.1 C34.1 C35.1 C36.1 C37.2 C38.2 C39#2.2 C40#2.2 C41#2.2 C42#2.2 C43#2.2 C44#2.1 C45#2.1 C46#2.1 C47#2.1 C48#2.1 C49#2.1 C50#2.2 C51#2.2 C53#2.2 C54#2.2 C55.2 C56.2 C57#2.2 C58#1.2 C61#1.1 C62.1 C63.1 C64.1 C65#2.1 C66#2.1 C67#2.1 C85.1 C86.1 C87.1 C88.1 C89.1 C90.1 C91.1 C92.1 C93.1 C94.1 C95.1 C96.1 C97.1 C98.2 C99.1 C100.2 C101.2 C102.2 C104#1.2 C105#1.2 C106#1.2 C107.2 C108.2 C109.1 C110.1 C111.1 C112.1 C113.1 C114.1 JP1#1.9 JP1#1.10 JP2#1.31 JP2#1.32 JP2#1.33 JP2#1.34 JP2#1.35 JP2#1.36 JP3.1 JP3.3 JP3.5 JP3.7 R1#2.1 R2#2.2 R3#2.2 R6#2.2 R7#2.2 R8#2.2 R12#1.1 R49.2 R51#2.2 R53.1 R62#2.1 U1#1.4(OSCVSS) U1#1.41(TESTMOOD) U1#1.65(VSS) U2#1.1(A0) U2#1.2(A1) U2#1.3(A2) U2#1.4(VSS) U2#1.7(WP) U3#1.A1(VSS) U3#1.A10(VSS) U3#1.A19(VSS) U3#1.E5(VSS) U3#1.E6(VSS) U3#1.E8(VSS) U3#1.E12(VSS) U3#1.E14(VSS) U3#1.E15(VSS) U3#1.F5(VSS) U3#1.F6(VSS) U3#1.F8(VSS) U3#1.F12(VSS) U3#1.F14(VSS) U3#1.F15(VSS) U3#1.G16(VSS) U3#1.G17(VSS) U3#1.H8(VSS) U3#1.H9(VSS) U3#1.H10(VSS) U3#1.H11(VSS) U3#1.H12(VSS) U3#1.H14(VSS) U3#1.H15(VSS) U3#1.J5(VSS) U3#1.J6(VSS) U3#1.J8(VSS) U3#1.J9(VSS) U3#1.J10(VSS) U3#1.J11(VSS) U3#1.J12(VSS) U3#1.K8(VSS) U3#1.K9(VSS) U3#1.K10(VSS) U3#1.K11(VSS) U3#1.K12(VSS) U3#1.K14(VSS) U3#1.K15(VSS) U3#1.L5(VSS) U3#1.L6(VSS) U3#1.L8(VSS) U3#1.L9(VSS) U3#1.L10(VSS) U3#1.L11(VSS) U3#1.L12(VSS) U3#1.L18(VSS) U3#1.M8(VSS) U3#1.M9(VSS) U3#1.M10(VSS) U3#1.M11(VSS) U3#1.M12(VSS) U3#1.M14(VSS) U3#1.M15(VSS) U3#1.N1(VSS) U3#1.N5(VSS) U3#1.N6(VSS) U3#1.P1(VSSA) U3#1.P2(VREFLOC) U3#1.P5(VSSA) U3#1.P7(VSS) U3#1.P8(VSS) U3#1.P11(VSS) U3#1.P12(VSS) U3#1.P14(VSS) U3#1.P15(VSS) U3#1.R2(VREFLOA) U3#1.R5(VSSA) U3#1.R7(VSS) U3#1.R8(VSS) U3#1.R14(VSS) U3#1.R15(VSS) U3#1.V6(VREFLOB) U3#1.V7(VSSA) U3#1.W1(VSSA) U3#1.W6(VREFLOD) U3#1.W7(VSS) U3#1.W19(VSS) U4#1.3(GND) U5#1.3(GND) U10.4(GND) U11.13(V-) U12.4(PGND1) U12.9(PGND2) U12.14(AGND) U12.17(DAP) U13#1.2(GND) U14#1.2(GND) Y1#1.2(GND) Y1#1.4(GND)
MCU_1V2: C37.1 C38.1 C39#2.1 C40#2.1 C41#2.1 C42#2.1 C43#2.1 C58#1.1 C108.1 C113.2 C114.2 L8.2 U3#1.E9(VDD) U3#1.E11(VDD) U3#1.F9(VDD) U3#1.F11(VDD) U3#1.G14(VDD) U3#1.G15(VDD) U3#1.J14(VDD) U3#1.J15(VDD) U3#1.K5(VDD) U3#1.K6(VDD) U3#1.P10(VDD) U3#1.P13(VDD) U3#1.R10(VDD) U3#1.R13(VDD)
MCU_3V3: C8#1.2 C9#1.2 C10#1.2 C11#1.2 C12#1.2 C13#1.2 C19#2.2 C20#2.2 C21#2.2 C22#2.2 C23#2.2 C24.2 C25.2 C26#2.2 C27#2.2 C28#2.2 C29#2.2 C30#2.2 C31#2.2 C32.2 C33.2 C34.2 C35.2 C36.2 C44#2.2 C45#2.2 C51#2.1 C55.1 C105#1.1 C106#1.1 C107.1 C111.2 C112.2 JP1#1.31 JP1#1.33 JP1#1.35 JP3.10 JP3.12 L1#2.1 L2#2.1 L3#2.1 L5.2 L7.1 LED5#1.1(A) R4#2.2 R9#2.2 R10#2.2 R14#1.1 R15#1.1 R52#2.2 R54#2.2 R55#2.1 U1#1.5(VDD33) U1#1.7(REG_EN) U1#1.14(VDDIO) U1#1.20(VDDIO) U1#1.32(VDDIO) U1#1.37(VDDIO) U1#1.47(VDDIO) U2#1.8(VCC) U3#1.A9(VDDIO) U3#1.A18(VDDIO) U3#1.B1(VDDIO) U3#1.E7(VDDIO) U3#1.E10(VDDIO) U3#1.E13(VDDIO) U3#1.E16(VDDIO) U3#1.F4(VDDIO) U3#1.F7(VDDIO) U3#1.F10(VDDIO) U3#1.F13(VDDIO) U3#1.F16(VDDIO) U3#1.G4(VDDIO) U3#1.G5(VDDIO) U3#1.G6(VDDIO) U3#1.H5(VDDIO) U3#1.H6(VDDIO) U3#1.J18(VREGENZ) U3#1.L14(VDDIO) U3#1.L15(VDDIO) U3#1.M1(VDDIO) U3#1.M5(VDDIO) U3#1.M6(VDDIO) U3#1.N14(VDDIO) U3#1.N15(VDDIO) U3#1.P9(VDDIO) U3#1.R9(VDDIO) U3#1.R11(VDD3VFL) U3#1.R12(VDD3VFL) U3#1.V19(VDDIO) U3#1.W8(VDDIO) U13#1.3(SENSE) U13#1.4(SET) U13#1.5(VDD) U14#1.4(SET) U14#1.5(VDD)
OSC_MCU_3V3: C48#2.2 C49#2.2 C56.1 L7.2 U3#1.H16(VDDOSC) U3#1.H17(VDDOSC)
VDDA_MCU_3V3: C46#2.2 C47#2.2 C54#2.1 C67#2.2 C85.2 C86.2 C87.2 C89.2 C96.2 C97.2 L6.2 U3#1.P6(VDDA) U3#1.R6(VDDA) U3#1.V2(ADCINB0) U4#1.6(VCC) U5#1.6(VCC) U10.2(VIN) U11.4(V+)
VDDCR: C1#2.1 C2#2.1 C14#1.2 C15#1.2 L4#1.1 U1#1.6(VDDCR1.2) U1#1.24(VDDCR) U1#1.38(VDDCR)
/RE: JP4.19 U3#1.J2(GPIO104)
ADCA0: JP2#1.3 R18#1.1
ADCA1: JP2#1.6 R21.1
ADCA2: JP2#1.5 R57#1.1
ADCA3: JP2#1.1 R16#1.1
ADCB2: JP2#1.7 R17#1.1
ADCB3: JP2#1.9 R20.1
ADCC2: JP4.21 R19#1.1
ADR1: U1#1.25(A1) U3#1.A4(GPIO92)
ADR2: U1#1.29(A2) U3#1.T16(GPIO38)
ADR3: U1#1.26(A3) U3#1.W17(GPIO39)
ADR4: U1#1.27(A4) U3#1.V17(GPIO40)
BISSC_CLK: JP4.17 U3#1.A6(GPIO6)
BISSC_DIN: JP4.20 U3#1.K3(GPIO24)
CAN_RX: JP3.6 U3#1.B2(GPIO10)
CAN_TX: JP3.8 U3#1.C2(GPIO12)
CAP1: JP4.12 U3#1.V12(GPIO115)
CAP2: JP4.2 U3#1.W10(GPIO116)
CAP3: JP4.14 U3#1.U12(GPIO117)
CHIP_MODE0: JP1#1.11 R2#2.1 U1#1.48(LINKACTLED0/TDO/CHIP_MODE0)
CHIP_MODE1: JP1#1.13 R3#2.1 U1#1.46(LINKACTLED1/TDI/CHIP_MODLE1)
CS: U1#1.28(CS) U3#1.U14(GPIO34)
DACC: JP4.22 R58#1.1
DATA0: U1#1.17(D0) U3#1.B11(GPIO85)
DATA1: U1#1.13(D1) U3#1.C14(GPIO83)
DATA2: U1#1.12(D2) U3#1.B14(GPIO82)
DATA3: U1#1.35(D3) U3#1.A14(GPIO81)
DATA4: U1#1.49(D4) U3#1.D15(GPIO80)
DATA5: U1#1.50(D5) U3#1.C15(GPIO79)
DATA6: U1#1.36(D6) U3#1.B15(GPIO78)
DATA7: U1#1.39(D7) U3#1.A15(GPIO77)
DATA8: U1#1.40(D8) U3#1.C16(GPIO76)
DATA9: U1#1.19(D9) U3#1.D16(GPIO75)
DATA10: U1#1.23(D10) U3#1.C17(GPIO74)
DATA11: U1#1.22(D11) U3#1.A16(GPIO73)
DATA12: R14#1.2 U1#1.21(D12) U3#1.B16(GPIO72)  [also labelled GPIO72]
DATA13: U1#1.16(D13) U3#1.B17(GPIO71)
DATA14: U1#1.15(D14) U3#1.A17(GPIO70)
DATA15: U1#1.33(A0/D15) U3#1.B18(GPIO69)
DC_CAL: JP1#1.17 U3#1.D1(GPIO13)
DE: JP4.18 U3#1.J1(GPIO103)
DigIN1: JP4.15 U3#1.V8(GPIO124)
DigIN2: JP4.13 U3#1.U9(GPIO126)
DigIN3: JP4.11 U3#1.V10(GPIO131)
DigIN4: JP4.9 U3#1.V11(GPIO28)
DigOUT1: JP4.3 U3#1.W16(GPIO121)
DigOUT2: JP4.1 U3#1.V16(GPIO36)
DigOUT3: JP4.7 U3#1.U13(GPIO32)
DigOUT4: JP4.5 U3#1.U15(GPIO120)
EEPSIZE: R4#2.1 R5#2.1 U1#1.45(RUNLED/E2PSIZE)
EESCL: R10#2.1 U1#1.43(EESCL/TCK) U2#1.6(SCL)
EESDA: R9#2.1 U1#1.42(EESDA/TMS) U2#1.5(SDA)
EMU0: R54#2.1
EMU1: R55#2.2
EN_GATE: JP1#1.30 U3#1.A2(GPIO97)
ERROR: U3#1.U19(ERRORSTS)
FXLOSEN: R6#2.1 U1#1.8(FXLOSEN)
FXSDA: R7#2.1 U1#1.9(FXSDA/FXLOSA/FXSDENA)
FXSDB: R8#2.1 U1#1.10(FXSDB/FXLOSB/FXSDENB)
GPIO1: R63#2.2 U3#1.F1(GPIO98)
GPIO2: R64#2.2 U3#1.G1(GPIO99)
GPIO3: R65#2.2 U3#1.H1(GPIO100)
GPIO84: R15#1.2 U3#1.A11(GPIO84)
INH_A: JP1#1.20 U3#1.C8(GPIO0)
INH_B: JP1#1.21 U3#1.A7(GPIO2)
INH_C: JP1#1.24 U3#1.C7(GPIO4)
INL_A: JP1#1.22 U3#1.D8(GPIO1)
INL_B: JP1#1.23 U3#1.B7(GPIO3)
INL_C: JP1#1.26 U3#1.D7(GPIO5)
IRQ: U1#1.44(IRQ) U3#1.T11(GPIO30)
LED1: JP2#1.29 U3#1.W18(GPIO132)
LED2: JP2#1.20 U3#1.W11(GPIO29)
LED3: JP2#1.22 U3#1.W9(GPIO128)
MCU_TCK: R56#2.2 U3#1.V15(TCK)
MCU_TDI: R59#1.2 U3#1.W13(TDI)
MCU_TDO: R11#1.1 R60#2.2
MCU_TMS: R59#1.1 U3#1.W14(TMS)
MCU_TRST: R12#1.2 R60#2.1 U3#1.V14(TRST_N)
nFAULT: JP1#1.18 U3#1.D2(GPIO14)
nOCTW: JP1#1.19 U3#1.C1(GPIO11)
OSC_GND: C59#1.2 C60#1.2 U3#1.H18(VSSOSC) U3#1.H19(VSSOSC) Y2.2(GND) Y2.4(GND)
QEP1A: JP4.6 U3#1.R18(GPIO50)
QEP1B: JP4.4 U3#1.R19(GPIO51)
QEP1I: JP4.10 U3#1.P17(GPIO53)
QEP1S: JP4.8 U3#1.P16(GPIO52)
RD: U1#1.31(RD/RD_WR) U3#1.U16(GPIO37)
REF3V0: C95.2 R44.2 U11.3(INA+) U11.5(INB+) U11.12(INC+) U11.14(IND+)
RST: C104#1.1 R52#2.1 U1#1.11(RST#) U3#1.F19(XRS_N) U13#1.1(UV) U14#1.1(UV)
RXA_N: JP1#1.3 U1#1.54(RXNA)
RXA_P: JP1#1.1 U1#1.55(RXPA)
RXB_N: JP1#1.4 U1#1.61(RXNB)
RXB_P: JP1#1.2 U1#1.60(RXPB)
SCI_RXD: JP3.4 U3#1.A3(GPIO94)
SCI_TXD: JP3.2 U3#1.B4(GPIO93)
SPI_CLK: U3#1.B6(GPIO7) U3#1.K1(GPIO26)
SPIA_CLK: JP1#1.14 U3#1.E3(GPIO18)
SPIA_CS: JP1#1.15 U3#1.E4(GPIO19)
SPIA_SIMO: JP1#1.16 U3#1.E1(GPIO16)
SPIA_SOMI: JP1#1.12 U3#1.E2(GPIO17)
SYNC0: U1#1.34(SYNC0/LATCH0) U3#1.D6(GPIO89)
SYNC1: U1#1.18(SYNC1/LATCH1) U3#1.B19(GPIO67)
TCK_RET: R56#2.1
TXA_N: JP1#1.7 U1#1.52(TXNA)
TXA_P: JP1#1.5 U1#1.53(TXPA)
TXB_N: JP1#1.8 U1#1.63(TXNB)
TXB_P: JP1#1.6 U1#1.62(TXPB)
VDD12TX1: C6#1.2 C7#1.2 L4#1.2 U1#1.56(VDD12TX1) U1#1.59(VDD12TX2)  [also labelled VDD12TX2]
VDD33BIAS: C5#1.2 L3#2.2 U1#1.58(VDD33BIAS)
VDD33TXRX1: C3#1.2 L1#2.2 U1#1.51(VDD33TXRX1)
VDD33TXRX2: C4#1.2 L2#2.2 U1#1.64(VDD33TXRX2)
VREFHIA: C90.2 U3#1.V1(VREFHIA) U11.1(OUTA) U11.2(INA-)
VREFHIB: C91.2 U3#1.W5(VREFHIB) U11.15(IND-) U11.16(OUTD)
VREFHIC: C92.2 U3#1.R1(VREFHIC) U11.6(INB-) U11.7(OUTB)
VREFHID: C93.2 U3#1.V5(VREFHID) U11.10(OUTC) U11.11(INC-)
WR: U1#1.30(WR/ENB) U3#1.U11(GPIO31)
NetC16#1_2: C16#1.2 U1#1.1(OSC1) Y1#1.1(X1)
NetC17#2_2: C17#2.2 U1#1.2(OSC2) Y1#1.3(X2)
NetC59#1_1: C59#1.1 U3#1.G19(X1) Y2.1(X1)
NetC60#1_1: C60#1.1 U3#1.J19(X2) Y2.3(X2)
NetC61#1_2: C61#1.2 R16#1.2 U3#1.T2(ADCINA3) U4#1.1(IO1)
NetC62_2: C62.2 R21.2 U3#1.T1(ADCINA1) U4#1.2(IO2)
NetC63_2: C63.2 R18#1.2 U3#1.U1(ADCINA0) U5#1.5(IO4)
NetC64_2: C64.2 R57#1.2 U3#1.U2(ADCINA2) U5#1.4(IO3)
NetC65#2_2: C65#2.2 R20.2 U3#1.W3(ADCINB3) U5#1.1(IO1)
NetC66#2_2: C66#2.2 R17#1.2 U3#1.V3(ADCINB2) U5#1.2(IO2)
NetC88_2: C88.2 U10.5(TRIM/NR)
NetC94_2: C94.2 R44.1 U10.6(VOUT)
NetC99_2: C99.2 R46#1.2 U12.15(VINC)
NetC109_2: C109.2 R19#1.2 U3#1.R3(ADCINC2) U4#1.4(IO3)
NetC110_2: C110.2 R58#1.2 U3#1.W2(ADCINB1)
NetL9_1: L9.1 U12.3(SW1)
NetL10_1: L10.1 U12.10(SW2)
NetLED4_2: LED4.2(K) R53.2
NetLED5#1_2: LED5#1.2(K) R5#2.2
NetR1#2_2: R1#2.2 U1#1.57(RBIAS)
NetR11#1_2: R11#1.2 U3#1.W15(TDO)
NetR48#2_1: R48#2.1 R49.1 U12.5(FB1)
NetR50_1: R50.1 R51#2.1 U12.8(FB2)
NetR62#2_2: R62#2.2 U3#1.L1(GPIO27)

Not connected (* = marked no-connect by the designer): JP1#1 25 27 28 29; JP2#1 2 4 8 10 11 12 13 14 15 16 17 18 19 21 23 24 25 26 27 28 30; JP4 16; R63#2 1; R64#2 1; R65#2 1; U1#1 3(OSCVDD12); U3#1 A5(GPIO90) A8(GPIO163) A12(GPIO153) A13(GPIO149) B3(GPIO95) B5(GPIO91) B8(GPIO164) B9(GPIO160) B10(GPIO157) B12(GPIO154) B13(GPIO150) C3(GPIO96) C4(GPIO167) C5(GPIO165) C6(GPIO88) C9(GPIO161) C10(GPIO158) C11(GPIO86) C12(GPIO155) C13(GPIO151) C18(GPIO68) C19(GPIO43) D3(GPIO15) D4(GPIO168) D5(GPIO166) D9(GPIO162) D10(GPIO159) D11(GPIO87) D12(GPIO156) D13(GPIO152) D14(GPIO148) D17(GPIO147) D18(GPIO146) D19(GPIO42) E17(GPIO145) E18(GPIO47) E19(GPIO46) F2(GPIO20) F3(GPIO21) F17(GPIO144) F18(GPIO143) G2(GPIO8) G3(GPIO9) G18(GPIO133) H2(GPIO101) H3(GPIO102) H4(NC) J3(GPIO105) J4(GPIO22) J16(GPIO63) J17(GPIO62) K2(GPIO25) K4(GPIO23) K16(GPIO65) K17(GPIO66) K18(GPIO44) K19(GPIO45) L2(GPIO106) L3(GPIO107) L4(GPIO108) L16(GPIO61) L17(GPIO64) L19(GPIO142) M2(GPIO110) M3(GPIO112) M4(GPIO111) M16(GPIO59) M17(GPIO60) M18(GPIO141) M19(GPIO140) N2(GPIO109) N3(GPIO114) N4(GPIO113) N16(GPIO56) N17(GPIO58) N18(GPIO57) N19(GPIO139) P3(ADCINC3) P4(ADCINC5) P18(GPIO54) P19(GPIO55) R4(ADCINC4) R16(GPIO48) R17(GPIO49) T3(ADCINA5) T4(ADCIN14) T5(ADCIND0) T6(ADCIND2) T7(ADCIND4) T8(GPIO122) T9(GPIO125) T10(GPIO129) T12(GPIO118) T13(GPIO33) T14(GPIO35) T15(GPIO119) T17(GPIO136) T18(GPIO137) T19(GPIO138) U3(ADCINA4) U4(ADCIN15) U5(ADCIND1) U6(ADCIND3) U7(ADCIND5) U8(GPIO123) U10(GPIO130) U17(GPIO41) U18(GPIO135) V4(ADCINB4) V9(GPIO127) V13(FLT2) V18(GPIO134) W4(ADCINB5) W12(FLT1); U4#1 5(IO4); U10 1(DNC) 3(TEMP) 7(NC) 8(DNC); U11 8(NC) 9(NC); U12 6(PG1) 7(PG2); U13#1 6(OV); U14#1 6(OV)

### Layout directives
differential pair: RXA_N, RXA_P, RXB_N, RXB_P, TXA_N, TXA_P, TXB_N, TXB_P

### Notes on the sheet
- GPIO
- EtherCAT
- 复位
- 配置
- 插座
- JTAG
- ADC
- 电源
- (in symbol LED Chip) GREEN

### Library data of the parts
C1#2 C2#2 C3#1 C4#1 C5#1 C6#1 C7#1 C8#1 C9#1 C10#1 C11#1 C12#1 C13#1 C14#1 C15#1 C16#1 C17#2 C19#2 C20#2 C21#2 C22#2 C23#2 C24 C25 C26#2 C27#2 C28#2 C29#2 C30#2 C31#2 C32-C38 C39#2 C40#2 C41#2 C42#2 C43#2 C44#2 C45#2 C46#2 C47#2 C48#2 C49#2 C50#2 C51#2 C53#2 C54#2 C55 C56 C57#2 C58#1 C59#1 C60#1 C61#1 C62-C64 C65#2 C66#2 C67#2 C85-C102 C104#1 C105#1 C106#1 C107-C114 = CAP
JP1#1 JP2#1 = Header 18X2: Header,36-Pin, Dual row; LatestRevisionDate: 17-Jul-2002; LatestRevisionNote: Re-released for DXP Platform.; Publisher: Altium Limited
JP3 = Header 6X2: Header, 6-Pin, Dual row; LatestRevisionDate: 17-Jul-2002; LatestRevisionNote: Re-released for DXP Platform.; Publisher: Altium Limited
JP4 = Header 11X2: Header, 10-Pin, Dual row; LatestRevisionDate: *; LatestRevisionNote: *; Publisher: *
L1#2 L2#2 L3#2 L4#1 L5-L8 = Inductor Iron: Magnetic-Core Inductor; Published: *; Revision: *; Publisher: *
L9 L10 = Inductor Chip: Inductor; Published: *; Revision: *; Publisher: *
LED4 LED5#1 = LED Chip: Typical Chip LED; Published: 8-Jun-2000; Revision: July-2002: Re-released for DXP Platform.; Publisher: Altium Limited
R1#2 R2#2 R3#2 R4#2 R5#2 R6#2 R7#2 R8#2 R9#2 R10#2 R11#1 R12#1 R14#1 R15#1 R16#1 R17#1 R18#1 R19#1 R20 R21 R44 R46#1 R48#2 R49 R50 R51#2 R52#2 R53 R54#2 R55#2 R56#2 R57#1 R58#1 R59#1 R60#2 R62#2 R63#2 R64#2 R65#2 = Resistor
U3#1 = TMS320F28377DZWT: Imported; PartNumber: TMS320F28377DZWTS; Manufacturer: Texas Instruments; RefDes: RefDes; Type: DEV; Value: Value
U4#1 U5#1 = TPD4E001_DRL_6: Imported; Vendor: Texas Instruments; PACKAGE_DESIGNATOR: DRL; PIN_COUNT: 6; FAMILY_NAME: ESD Solution; INDUSTRY_STD_PKG_TYPE: SOT; Manufacturer_Part_Number: tpd4e001_drl_6; GENERIC_PART_NUMBER: TPD4E001; Datasheet URL: http://www.ti.com/lit/gpn/TPD4E001; Manufacturer: Texas Instruments; RefDes: RefDes; Type: DEV; Value: Value
U10 = REF5030_D_8: Imported; Manufacturer: Texas Instruments; INDUSTRY_STD_PKG_TYPE: SOIC; FAMILY_NAME: SERIES VOLTAGE REFERENCE; PIN_COUNT: 8; PACKAGE_DESIGNATOR: D; Datasheet URL: http://www.ti.com/lit/gpn/REF5030; GENERIC_PART_NUMBER: REF5030; Vendor: Texas Instruments; Manufacturer_Part_Number: ref5030_d_8; RefDes: RefDes; Type: DEV; Value: Value
U11 = OPA4350_DBQ_16: Imported; Manufacturer: Texas Instruments; INDUSTRY_STD_PKG_TYPE: SSOP/QSOP; FAMILY_NAME: LOW OFFSET VOLTAGE; PIN_COUNT: 16; PACKAGE_DESIGNATOR: DBQ; Datasheet URL: http://www.ti.com/lit/gpn/OPA4350; GENERIC_PART_NUMBER: OPA4350; Vendor: Texas Instruments; Manufacturer_Part_Number: opa4350_dbq_16; RefDes: RefDes; Type: DEV; Value: Value
U12 = LM26420Q1XSQ/NOP: Imported; PartNumber: LM26420Q1XSQ/NOPB; Manufacturer: Texas Instruments; CompType: IC; PIN_COUNT: 17; PackageReference: RUM0016A; MountType: SMT; RoHS: Y; RefDes: RefDes; Type: DEV; Value: Value
U13#1 U14#1 = TPS3702CX33DDCR: Imported; Alternate PartNumber: TPS3702CX33DDCT; Manufacturer: Texas Instruments; CompType: IC; PIN_COUNT: 6; PartNumber: TPS3702CX33DDCR; PackageReference: DDC0006A; MountType: SMT; RefDes: RefDes; Type: DEV; Value: Value
Y1#1 = XTAL1

## Sheet encoder.SchDoc
size A3
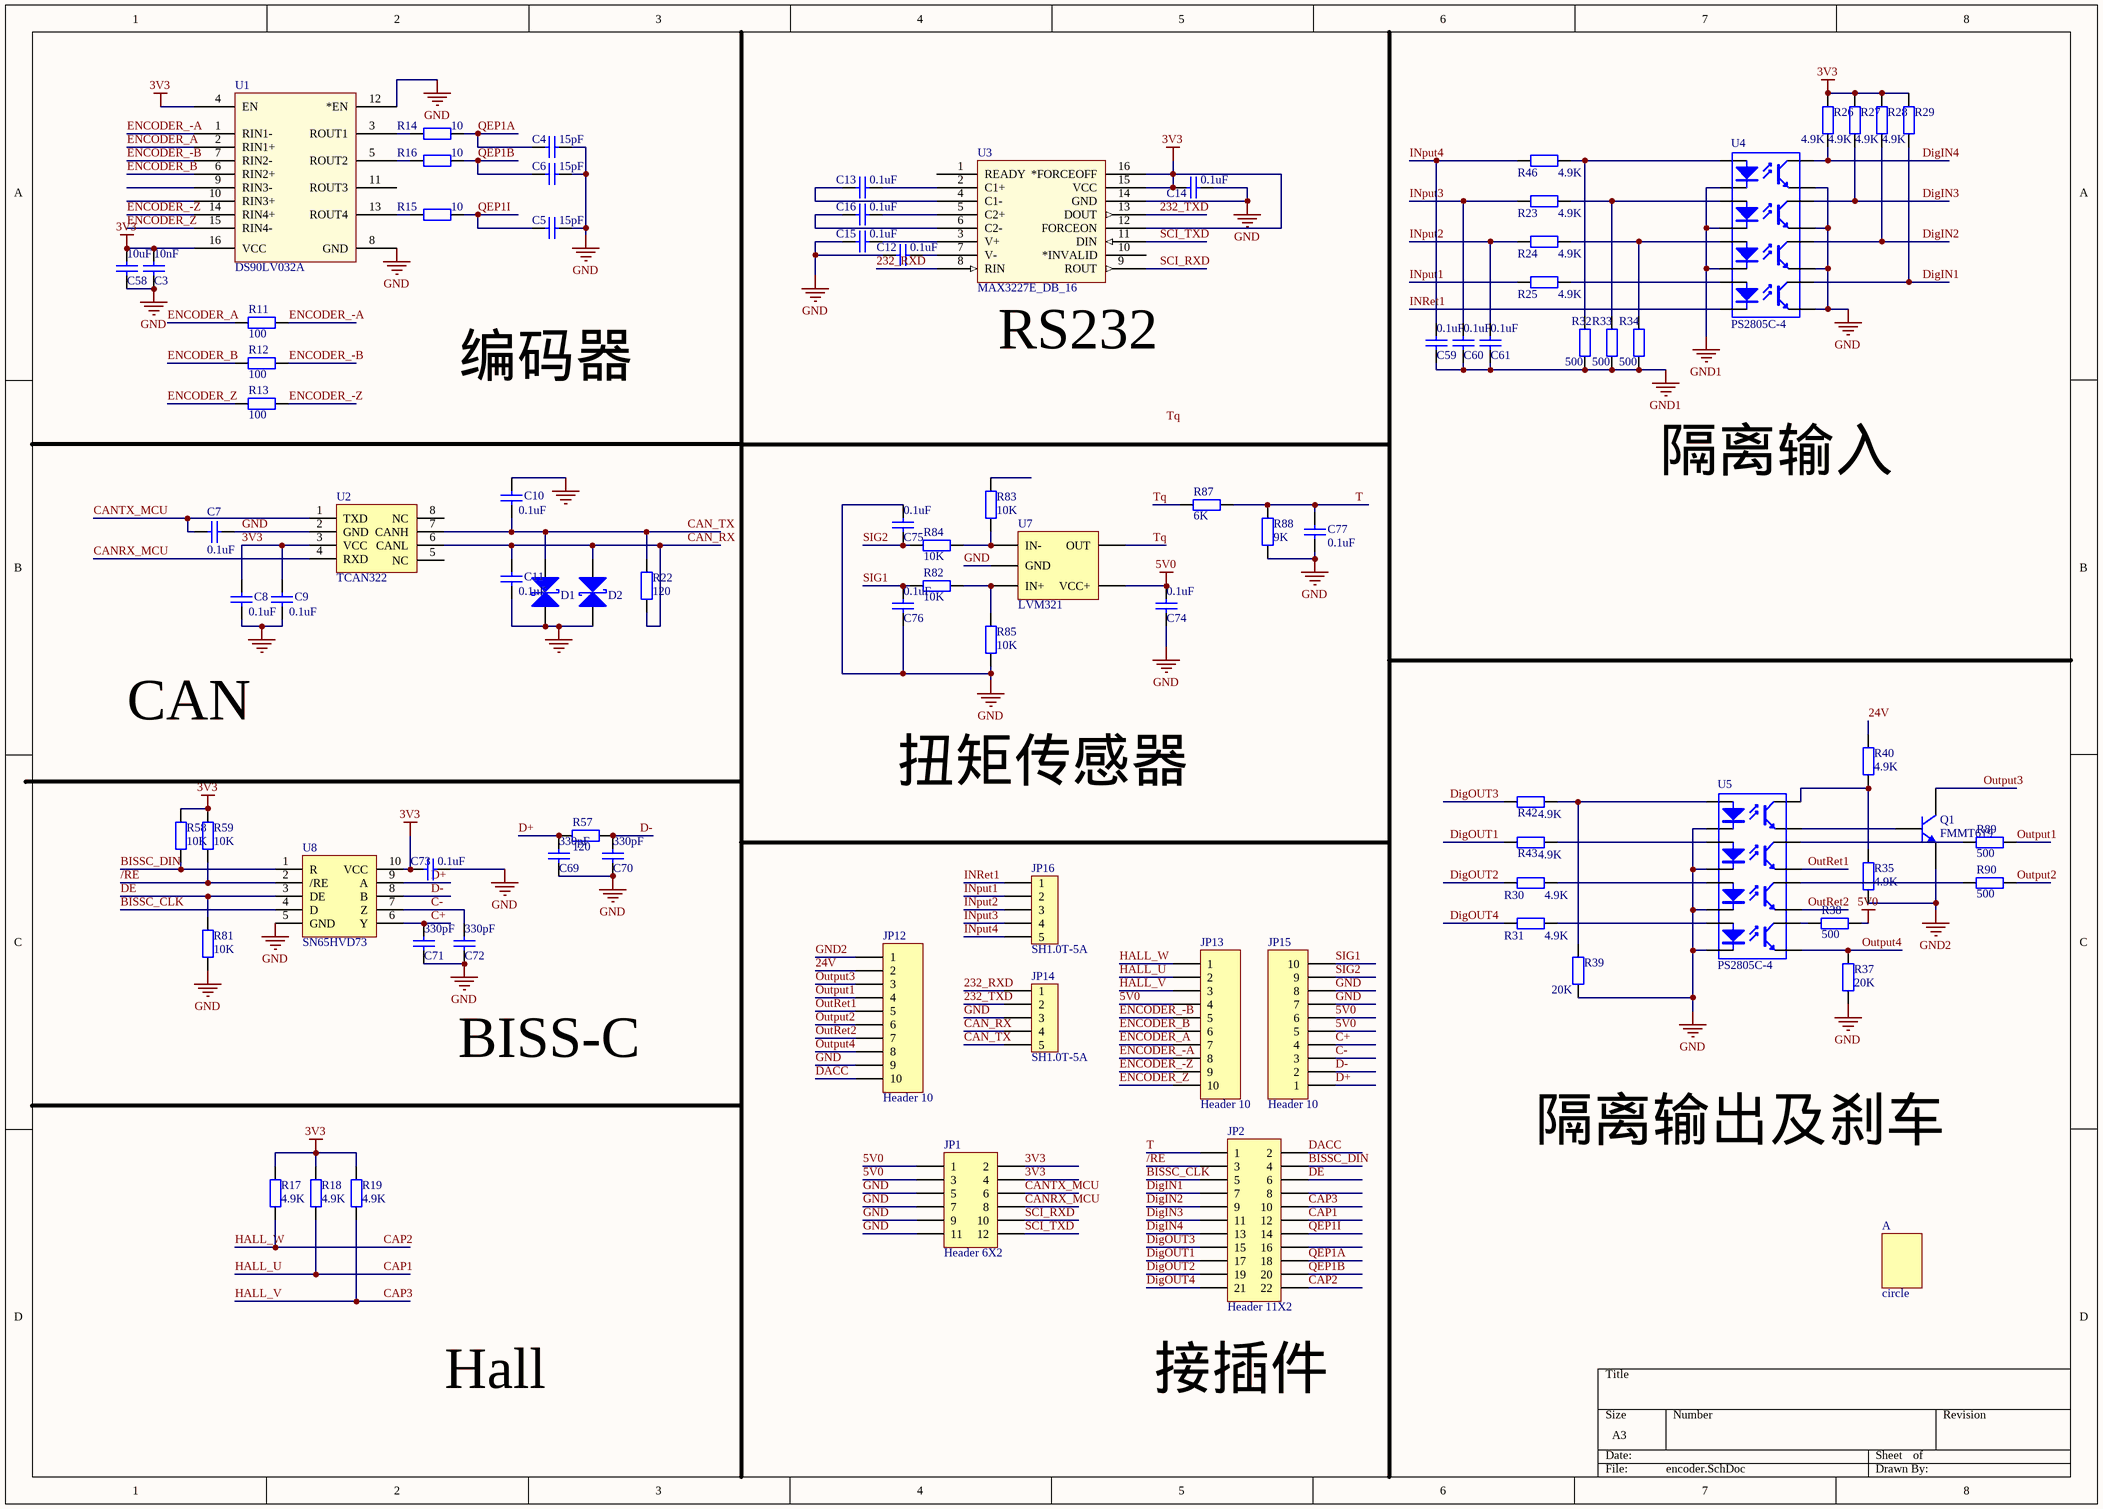
[diagram p3: encoder.SchDoc]

### Parts
(Parts that share a designator on the sheet are numbered #1, #2 ... from top to bottom, then left to right.)
A#3  circle  [Circle]
C3#2  value 10nF  [CC1608-0603]  (hidden comment: 0603B103J6R3NT)
C4#2  value 15pF  [CC1608-0603]  (hidden comment: 0603B150J6R3NT)
C5#2  value 15pF  [CC1608-0603]  (hidden comment: 0603B150J6R3NT)
C6#2  value 15pF  [CC1608-0603]  (hidden comment: 0603B150J6R3NT)
C7#2  value 0.1uF  [CC1608-0603]  (hidden comment: 0603B104J6R3NT)
C8#2  value 0.1uF  [CC1608-0603]  (hidden comment: 0603B104J6R3NT)
C9#2  value 0.1uF  [CC1608-0603]  (hidden comment: 0603B104J6R3NT)
C10#2  value 0.1uF  [CC1608-0603]  (hidden comment: 0603B104J6R3NT)
C11#2  value 0.1uF  [CC1608-0603]  (hidden comment: 0603B104J6R3NT)
C12#2  value 0.1uF  [CC1608-0603]  (hidden comment: 0603B104J6R3NT)
C13#2  value 0.1uF  [CC1608-0603]  (hidden comment: 0603B104J6R3NT)
C14#2  value 0.1uF  [CC1608-0603]  (hidden comment: 0603B104J6R3NT)
C15#2  value 0.1uF  [CC1608-0603]  (hidden comment: 0603B104J6R3NT)
C16#2  value 0.1uF  [CC1608-0603]  (hidden comment: 0603B104J6R3NT)
C58#2  value 10uF  [CC2012-0805]  (hidden comment: 0805B106J100NT)
C59#2  value 0.1uF  [CC1608-0603]  (hidden comment: 0603B104J6R3NT)
C60#2  value 0.1uF  [CC1608-0603]  (hidden comment: 0603B104J6R3NT)
C61#2  value 0.1uF  [CC1608-0603]  (hidden comment: 0603B104J6R3NT)
C69  value 330pF  [CC1608-0603]  (hidden comment: 0603B331J6R3NT)
C70  value 330pF  [CC1608-0603]  (hidden comment: 0603B331J6R3NT)
C71  value 330pF  [CC1608-0603]  (hidden comment: 0603B331J6R3NT)
C72  value 330pF  [CC1608-0603]  (hidden comment: 0603B331J6R3NT)
C73  value 0.1uF  [CC1608-0603]  (hidden comment: 0603B104J6R3NT)
C74  value 0.1uF  [CC1608-0603]  (hidden comment: 0603B104J6R3NT)
C75  value 0.1uF  [CC1608-0603]  (hidden comment: 0603B104J6R3NT)
C76  value 0.1uF  [CC1608-0603]  (hidden comment: 0603B104J6R3NT)
C77  value 0.1uF  [CC1608-0603]  (hidden comment: 0603B104J6R3NT)
D1  Diode Schottky  [TVS]  (value not drawn)
D2  Diode Schottky  [TVS]  (value not drawn)
JP1#2  Header 6X2  [DC_1.27_12]
JP2#2  Header 11X2  [DC_1.27_22]
JP12  Header 10  [SH1.0T-10A]
JP13  Header 10  [SH1.0T-10A]
JP14  SH1.0T-5A  [SH1.0T-5A]
JP15  Header 10  [SH1.0T-10A]
JP16  SH1.0T-5A  [SH1.0T-5A]
Q1  FMMT619  [SOT-23]
R11#2  value 100  [CR1608-0603]  (hidden comment: RC03K101JT)
R12#2  value 100  [CR1608-0603]  (hidden comment: RC03K101JT)
R13  value 100  [CR1608-0603]  (hidden comment: RC03K101JT)
R14#2  value 10  [CR1608-0603]  (hidden comment: RC03K100JT)
R15#2  value 10  [CR1608-0603]  (hidden comment: RC03K100JT)
R16#2  value 10  [CR1608-0603]  (hidden comment: RC03K100JT)
R17#2  value 4.9K  [CR1608-0603]  (hidden comment: RC03K492JT)
R18#2  value 4.9K  [CR1608-0603]  (hidden comment: RC03K492JT)
R19#2  value 4.9K  [CR1608-0603]  (hidden comment: RC03K492JT)
R22  value 120  [CR1608-0603]  (hidden comment: RC03K121JT)
R23  value 4.9K  [CR1608-0603]  (hidden comment: RC03K492JT)
R24  value 4.9K  [CR1608-0603]  (hidden comment: RC03K492JT)
R25  value 4.9K  [CR1608-0603]  (hidden comment: RC03K492JT)
R26  value 4.9K  [CR1608-0603]  (hidden comment: RC03K492JT)
R27  value 4.9K  [CR1608-0603]  (hidden comment: RC03K492JT)
R28  value 4.9K  [CR1608-0603]  (hidden comment: RC03K492JT)
R29  value 4.9K  [CR1608-0603]  (hidden comment: RC03K492JT)
R30  value 4.9K  [CR1608-0603]  (hidden comment: RC03K492JT)
R31  value 4.9K  [CR1608-0603]  (hidden comment: RC03K492JT)
R32  value 500  [CR1608-0603]  (hidden comment: RC03K501JT)
R33  value 500  [CR1608-0603]  (hidden comment: RC03K501JT)
R34  value 500  [CR1608-0603]  (hidden comment: RC03K501JT)
R35  value 4.9K  [CR1608-0603]  (hidden comment: RC03K492JT)
R37  value 20K  [CR1608-0603]  (hidden comment: RC03K203JT)
R38  value 500  [CR1608-0603]  (hidden comment: RC03K501JT)
R39  value 20K  [CR1608-0603]  (hidden comment: RC03K203JT)
R40  value 4.9K  [CR1608-0603]  (hidden comment: RC03K492JT)
R42  value 4.9K  [CR1608-0603]  (hidden comment: RC03K492JT)
R43  value 4.9K  [CR1608-0603]  (hidden comment: RC03K492JT)
R46#2  value 4.9K  [CR1608-0603]  (hidden comment: RC03K492JT)
R57#2  value 120  [CR1608-0603]  (hidden comment: RC03K121JT)
R58#2  value 10K  [CR1608-0603]  (hidden comment: RC03K103JT)
R59#2  value 10K  [CR1608-0603]  (hidden comment: RC03K103JT)
R81  value 10K  [CR1608-0603]  (hidden comment: RC03K103JT)
R82  value 10K  [CR1608-0603]  (hidden comment: RC03K103JT)
R83  value 10K  [CR1608-0603]  (hidden comment: RC03K103JT)
R84  value 10K  [CR1608-0603]  (hidden comment: RC03K103JT)
R85  value 10K  [CR1608-0603]  (hidden comment: RC03K103JT)
R87  value 6K  [CR1608-0603]  (hidden comment: RC03K602JT)
R88  value 9K  [CR1608-0603]  (hidden comment: RC03K902JT)
R89  value 500  [CR1608-0603]  (hidden comment: RC03K501JT)
R90  value 500  [CR1608-0603]  (hidden comment: RC03K501JT)
U1#2  DS90LV032A  [DS90LV032A]
U2#2  TCAN322  [TCAN332]
U3#2  MAX3227E_DB_16  [MAX3227E]
U4#2  PS2805C-4  [PS2805C_4]
U5#2  PS2805C-4  [PS2805C_4]
U7#2  LVM321  [LVM321]
U8  SN65HVD73  [SN65HVD73]

### Nets
3V3: C3#2.2 C8#2.2 C9#2.2 C14#2.2 C58#2.2 C73.1 JP1#2.2 JP1#2.4 R17#2.1 R18#2.1 R19#2.1 R26.2 R27.2 R28.2 R29.2 R58#2.1 R59#2.1 U1#2.4(EN) U1#2.16(VCC) U2#2.3(VCC) U3#2.12(FORCEON) U3#2.15(VCC) U3#2.16(*FORCEOFF) U8.10(VCC)
5V0: C74.2 JP1#2.1 JP1#2.3 JP13.4 JP15.5 JP15.6 R38.1 U7#2.5(VCC+)
GND: C3#2.1 C4#2.2 C5#2.1 C6#2.1 C7#2.1 C8#2.1 C9#2.1 C10#2.2 C11#2.1 C12#2.2 C14#2.1 C15#2.1 C58#2.1 C69.1 C70.1 C71.1 C72.1 C73.2 C74.1 C75.2 C76.1 C77.2 D1.1(A) D2.1(A) JP1#2.5 JP1#2.7 JP1#2.9 JP1#2.11 JP12.9 JP14.3 JP15.7 JP15.8 R37.1 R39.1 R81.2 R85.1 R88.2 U1#2.8(GND) U1#2.12(*EN) U2#2.2(GND) U3#2.14(GND) U4#2.9(A) U4#2.11(A) U4#2.13(A) U4#2.15(E) U5#2.2(K) U5#2.4(A) U5#2.6(A) U5#2.8(A) U7#2.2(GND) U8.5(GND)
GND1: C59#2.1 C60#2.1 C61#2.1 R32.2 R33.2 R34.2 U4#2.2(K) U4#2.4(A) U4#2.6(A)
GND2: JP12.1 Q1.2(E) R35.1
24V: JP12.2 R40.2
232_RXD: JP14.1 U3#2.8(RIN)
232_TXD: JP14.2 U3#2.13(DOUT)
/RE: JP2#2.3 R59#2.2 U8.2(/RE)
BISSC_CLK: JP2#2.5 U8.4(D)
BISSC_DIN: JP2#2.4 R58#2.2 U8.1(R)
C+: C71.2 JP15.4 U8.6(Y)
C-: C72.2 JP15.3 U8.7(Z)
CAN_RX: C11#2.2 D2.2(K) JP14.4 R22.1 U2#2.6(CANL)
CAN_TX: C10#2.1 D1.2(K) JP14.5 R22.2 U2#2.7(CANH)
CANRX_MCU: JP1#2.8 U2#2.4(RXD)
CANTX_MCU: C7#2.2 JP1#2.6 U2#2.1(TXD)
CAP1: JP2#2.12 JP13.2 R18#2.2  [also labelled HALL_U]
CAP2: JP2#2.22 JP13.1 R17#2.2  [also labelled HALL_W]
CAP3: JP2#2.10 JP13.3 R19#2.2  [also labelled HALL_V]
D+: C69.2 JP15.1 R57#2.2 U8.9(A)
D-: C70.2 JP15.2 R57#2.1 U8.8(B)
DACC: JP2#2.2 JP12.10
DE: JP2#2.6 R81.1 U8.3(DE)
DigIN1: JP2#2.7 R29.1 U4#2.10(A)
DigIN2: JP2#2.9 R28.1 U4#2.12(A)
DigIN3: JP2#2.11 R27.1 U4#2.14(A)
DigIN4: JP2#2.13 R26.1 U4#2.16(C)
DigOUT1: JP2#2.17 R43.2
DigOUT2: JP2#2.19 R30.2
DigOUT3: JP2#2.15 R42.2
DigOUT4: JP2#2.21 R31.2
ENCODER_-A: JP13.8 R11#2.1 U1#2.1(RIN1-)
ENCODER_-B: JP13.5 R12#2.1 U1#2.7(RIN2-)
ENCODER_-Z: JP13.9 R13.1 U1#2.14(RIN4+)
ENCODER_A: JP13.7 R11#2.2 U1#2.2(RIN1+)
ENCODER_B: JP13.6 R12#2.2 U1#2.6(RIN2+)
ENCODER_Z: JP13.10 R13.2 U1#2.15(RIN4-)
INput1: JP16.2 R25.2
INput2: C61#2.2 JP16.3 R24.2
INput3: C60#2.2 JP16.4 R23.2
INput4: C59#2.2 JP16.5 R46#2.2
INRet1: JP16.1 U4#2.8(A)
Output1: JP12.4 R89.1
Output2: JP12.6 R90.1
Output3: JP12.3 Q1.3(C)
Output4: JP12.8 R37.2 U5#2.9(A)
OutRet1: JP12.5 U5#2.13(A)
OutRet2: JP12.7 U5#2.11(A)
QEP1A: C4#2.1 JP2#2.18 R14#2.1
QEP1B: C6#2.2 JP2#2.20 R16#2.1
QEP1I: C5#2.2 JP2#2.14 R15#2.1
SCI_RXD: JP1#2.10 U3#2.9(ROUT)
SCI_TXD: JP1#2.12 U3#2.11(DIN)
SIG1: C76.2 JP15.10 R82.1
SIG2: C75.1 JP15.9 R84.1
T: C77.1 JP2#2.1 R87.1 R88.1
Tq: R87.2 U7#2.4(OUT)
NetC12#2_1: C12#2.1 U3#2.7(V-)
NetC13#2_1: C13#2.1 U3#2.2(C1+)
NetC13#2_2: C13#2.2 U3#2.4(C1-)
NetC15#2_2: C15#2.2 U3#2.3(V+)
NetC16#2_1: C16#2.1 U3#2.5(C2+)
NetC16#2_2: C16#2.2 U3#2.6(C2-)
NetQ1_1: Q1.1(B) U5#2.15(E)
NetR14#2_2: R14#2.2 U1#2.3(ROUT1)
NetR15#2_2: R15#2.2 U1#2.13(ROUT4)
NetR16#2_2: R16#2.2 U1#2.5(ROUT2)
NetR23_1: R23.1 R33.1 U4#2.3(A)
NetR24_1: R24.1 R34.1 U4#2.5(A)
NetR25_1: R25.1 U4#2.7(A)
NetR30_1: R30.1 U5#2.5(A)
NetR31_1: R31.1 U5#2.7(A)
NetR32_1: R32.1 R46#2.1 U4#2.1(A)
NetR35_2: R35.2 R40.1 U5#2.16(C)
NetR38_2: R38.2 U5#2.10(A)
NetR39_2: R39.2 R42.1 U5#2.1(A)
NetR43_1: R43.1 U5#2.3(A)
NetR82_2: R82.2 R85.2 U7#2.1(IN+)
NetR83_1: R83.1 R84.2 U7#2.3(IN-)
NetR89_2: R89.2 U5#2.14(A)
NetR90_2: R90.2 U5#2.12(A)

Not connected (* = marked no-connect by the designer): JP2#2 8 16; R83 2; U1#2 9(RIN3-) 10(RIN3+) 11(ROUT3); U2#2 5(NC) 8(NC); U3#2 1(READY) 10(*INVALID)

### Notes on the sheet
- (near U3#2) RS232
- 编码器
- 隔离输入
- CAN
- 扭矩传感器
- BISS-C
- 隔离输出及刹车
- Hall
- (near JP2#2) 接插件
- Labels drawn without touching a wire or pin: Tq

### Library data of the parts
C3#2 C4#2 C5#2 C6#2 C7#2 C8#2 C9#2 C10#2 C11#2 C12#2 C13#2 C14#2 C15#2 C16#2 C58#2 C59#2 C60#2 C61#2 C69-C77 = CAP
D1 D2 = Diode Schottky: Schottky Diode; Published: 8-Jun-2000; LatestRevisionDate: 17-Jul-2002; LatestRevisionNote: Re-released for DXP Platform.; PackageReference: SMB; Publisher: Altium Limited; Code_JEDEC: DO-214-AA
JP1#2 = Header 6X2: Header, 6-Pin, Dual row; LatestRevisionDate: 17-Jul-2002; LatestRevisionNote: Re-released for DXP Platform.; Publisher: Altium Limited
JP2#2 = Header 11X2: Header, 10-Pin, Dual row; LatestRevisionDate: *; LatestRevisionNote: *; Publisher: *
JP12 JP13 JP15 = Header 10: Header, 10-Pin; LatestRevisionDate: 17-Jul-2002; LatestRevisionNote: Re-released for DXP Platform.; Publisher: Altium Limited
Q1 = NPN: NPN Bipolar Transistor; Published: *; Revision: *; Publisher: *; Code - JEDEC: *
R11#2 R12#2 R13 R14#2 R15#2 R16#2 R17#2 R18#2 R19#2 R22-R35 R37-R40 R42 R43 R46#2 R57#2 R58#2 R59#2 R81-R85 R87-R90 = Resistor
U3#2 = MAX3227E_DB_16: Imported; Manufacturer: Texas Instruments; INDUSTRY_STD_PKG_TYPE: SSOP; FAMILY_NAME: RS-232; PIN_COUNT: 16; PACKAGE_DESIGNATOR: DB; Datasheet URL: http://www.ti.com/lit/gpn/MAX3227E; GENERIC_PART_NUMBER: MAX3227E; Vendor: Texas Instruments; Manufacturer_Part_Number: max3227e_db_16; RefDes: RefDes; Type: DEV; Value: Value
U4#2 U5#2 = PS2805C-4: Optoisolator; Published: *; Revision: *; Publisher: *